# Altium project I2C_Jog_Controller.PrjPCB
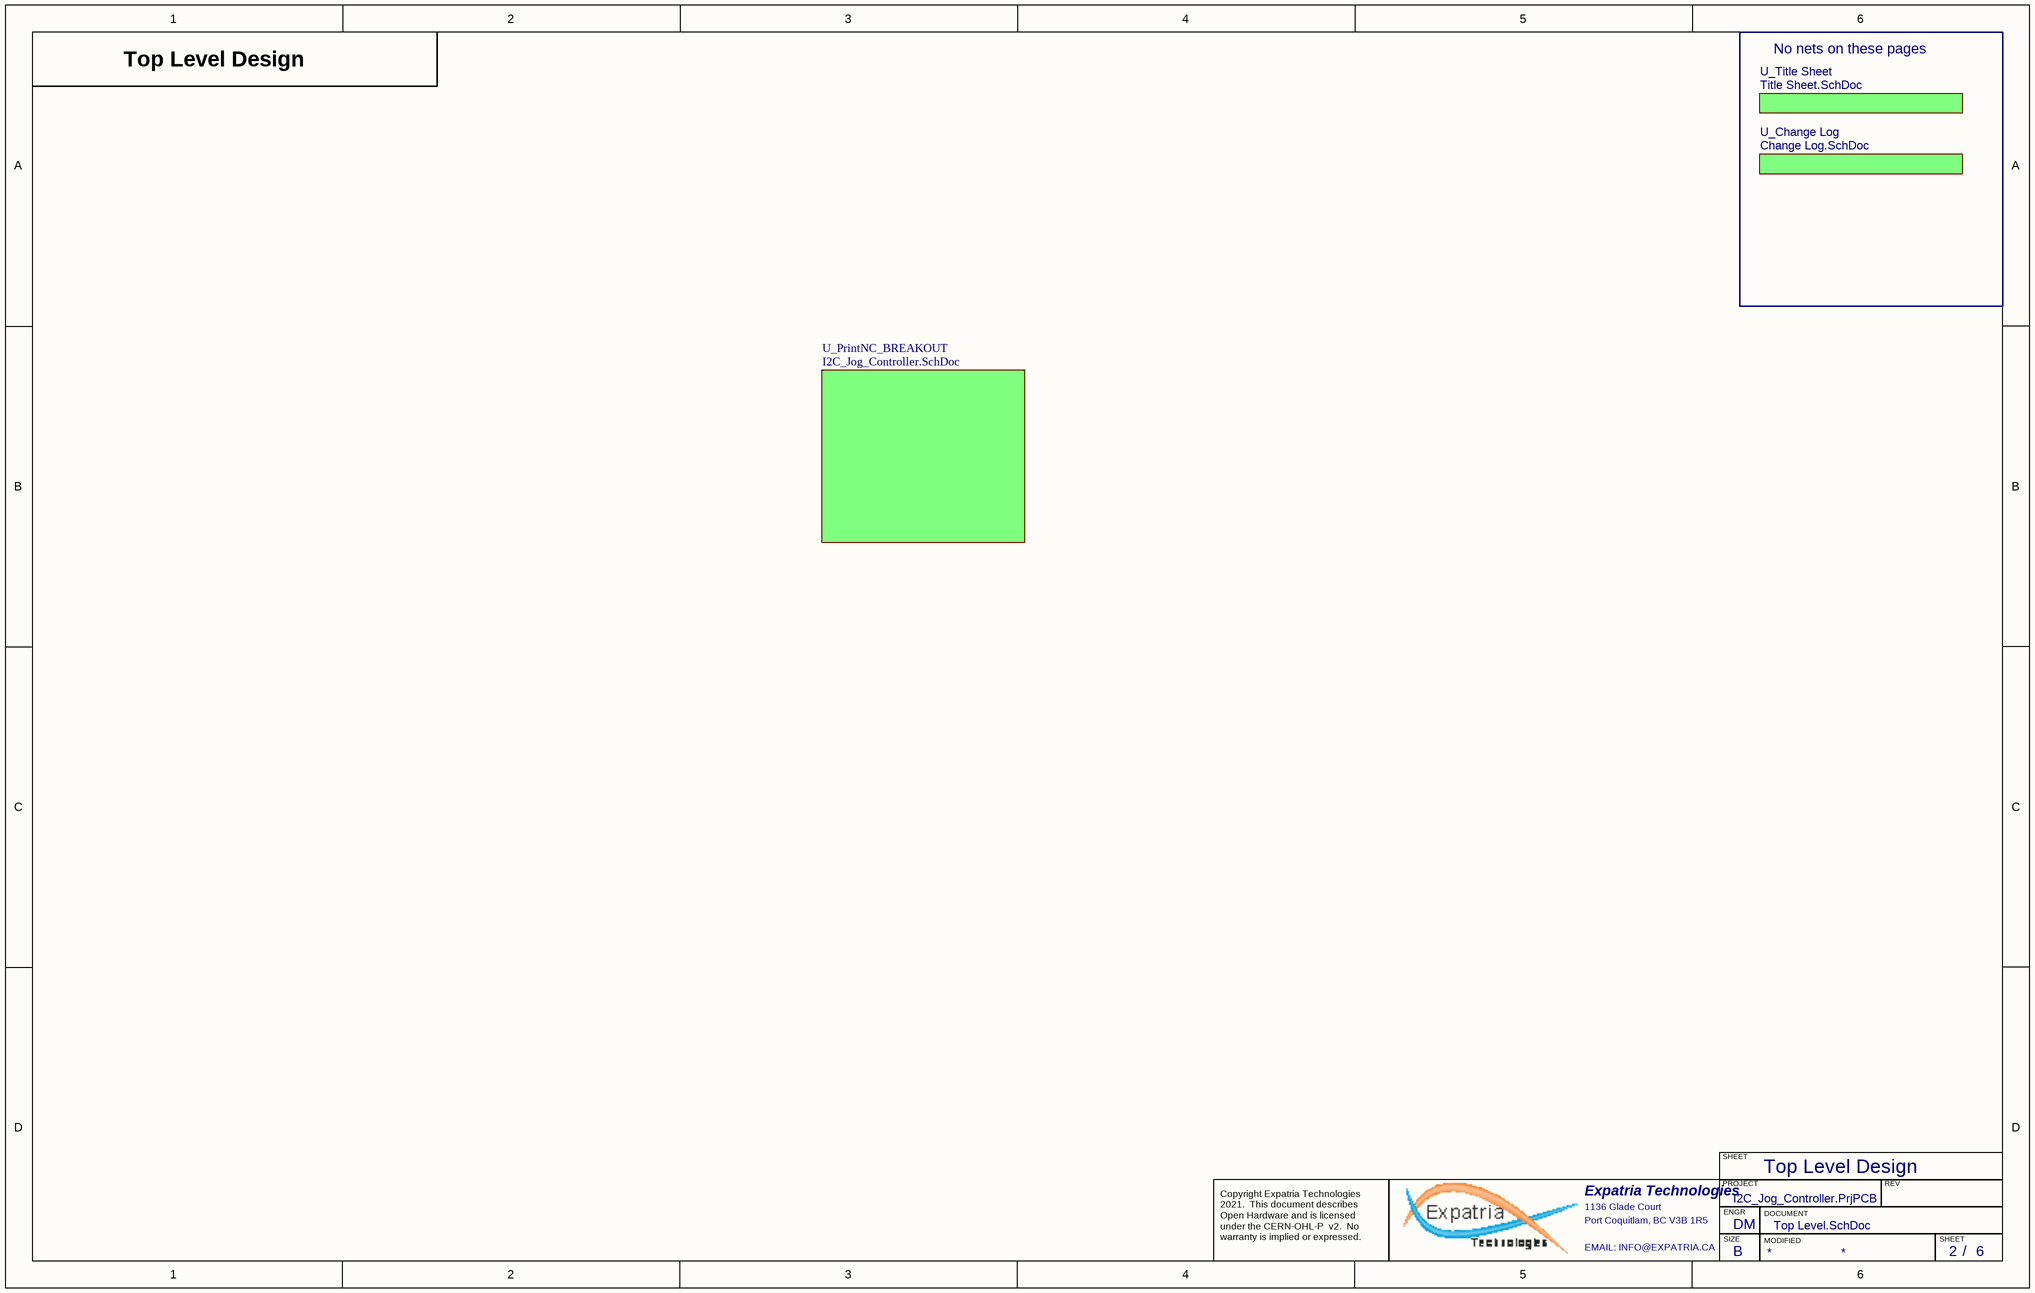
[diagram p0: Top Level.SchDoc]
PCBPARTNO: JOG_CONTROLLER; PCBREVNO: A6; Title: JOG_CONTROLLER; VarRevNo: A6
8 sheets, 212 parts. Net scope: hierarchical (ports join the sheet entries above them; power ports are global).
Board file: I2C_Jog_Controller.pcbdoc
Sheets:
  Top Level.SchDoc
    U_Title Sheet = Title Sheet.SchDoc
    U_PrintNC_BREAKOUT = I2C_Jog_Controller.SchDoc
      EXT_KEYPAD = I2C_Keypad.SchDoc
      UP = PushButtondirection.SchDoc
      DN = PushButtondirection.SchDoc
      LT = PushButtondirection.SchDoc
      RT = PushButtondirection.SchDoc
      RI = PushButtondirection.SchDoc
      LW = PushButtondirection.SchDoc
      JS = PushButtondirection.SchDoc
      FU = PushButtondirection.SchDoc
      FD = PushButtondirection.SchDoc
      FR = PushButtondirection.SchDoc
      SU = PushButtondirection.SchDoc
      SD = PushButtondirection.SchDoc
      SR = PushButtondirection.SchDoc
      SPN = PushButtonBlack.SchDoc
      FLD = PushButtondirection.SchDoc
      MST = PushButtondirection.SchDoc
      CYC = PushButtonBlack.SchDoc
      FHL = PushButtonBlack.SchDoc
      HLT = PushButtonBlack.SchDoc
      HME = PushButtonBlack.SchDoc
      EXT_KEYPAD_HOST = I2C_Keypad_host_module.SchDoc
  RP2040_MCU.SchDoc

## Sheet Top Level.SchDoc: JOG_CONTROLLER
size B; Author: DM; CompanyName: Silver Bullet Technology LLC; DrawnBy: D.McIntire; Engineer: DM; Organization: Silver Bullet Technology; Address1: Schematic; Address2: 5300 Via Andrea; Address3: Newbury Park, CA 91320; Address4: USA; DocumentNumber: 2; Revision: A6; SheetNumber: 2; SheetTotal: 6; PCB_Rev: A6

### Sub-sheets
U_Change Log = Change Log.SchDoc (file not in this document): no entries
U_PrintNC_BREAKOUT = I2C_Jog_Controller.SchDoc: no entries
U_Title Sheet = Title Sheet.SchDoc: no entries

### Notes on the sheet
- Top Level Design
- No nets on these pages
- SHEET
- Expatria Technologies
- 1136 Glade Court
- Port Coquitlam, BC V3B 1R5
- PROJECT
- SIZE
- ENGR
- MODIFIED
- DOCUMENT
- REV
- Copyright Expatria Technologies 2021.  This document describes Open Hardware and is licensed under the CERN-OHL-P  v2.  No warranty is implied or expressed.
- EMAIL: INFO@EXPATRIA.CA
- B
- /

## Sheet Title Sheet.SchDoc: Bluebell MFG PCB
size B; Author: AM; CompanyName: Cambridge Mobile Telematics; DrawnBy: A.Marles; Engineer: DM; Organization: Silver Bullet Technology; Address1: Schematic; Address2: 101 Main Street, 14th Floor; Address3: Cambridge, MA 02142; Address4: USA; DocumentNumber: 1; Revision: A6; SheetNumber: 1; SheetTotal: 6
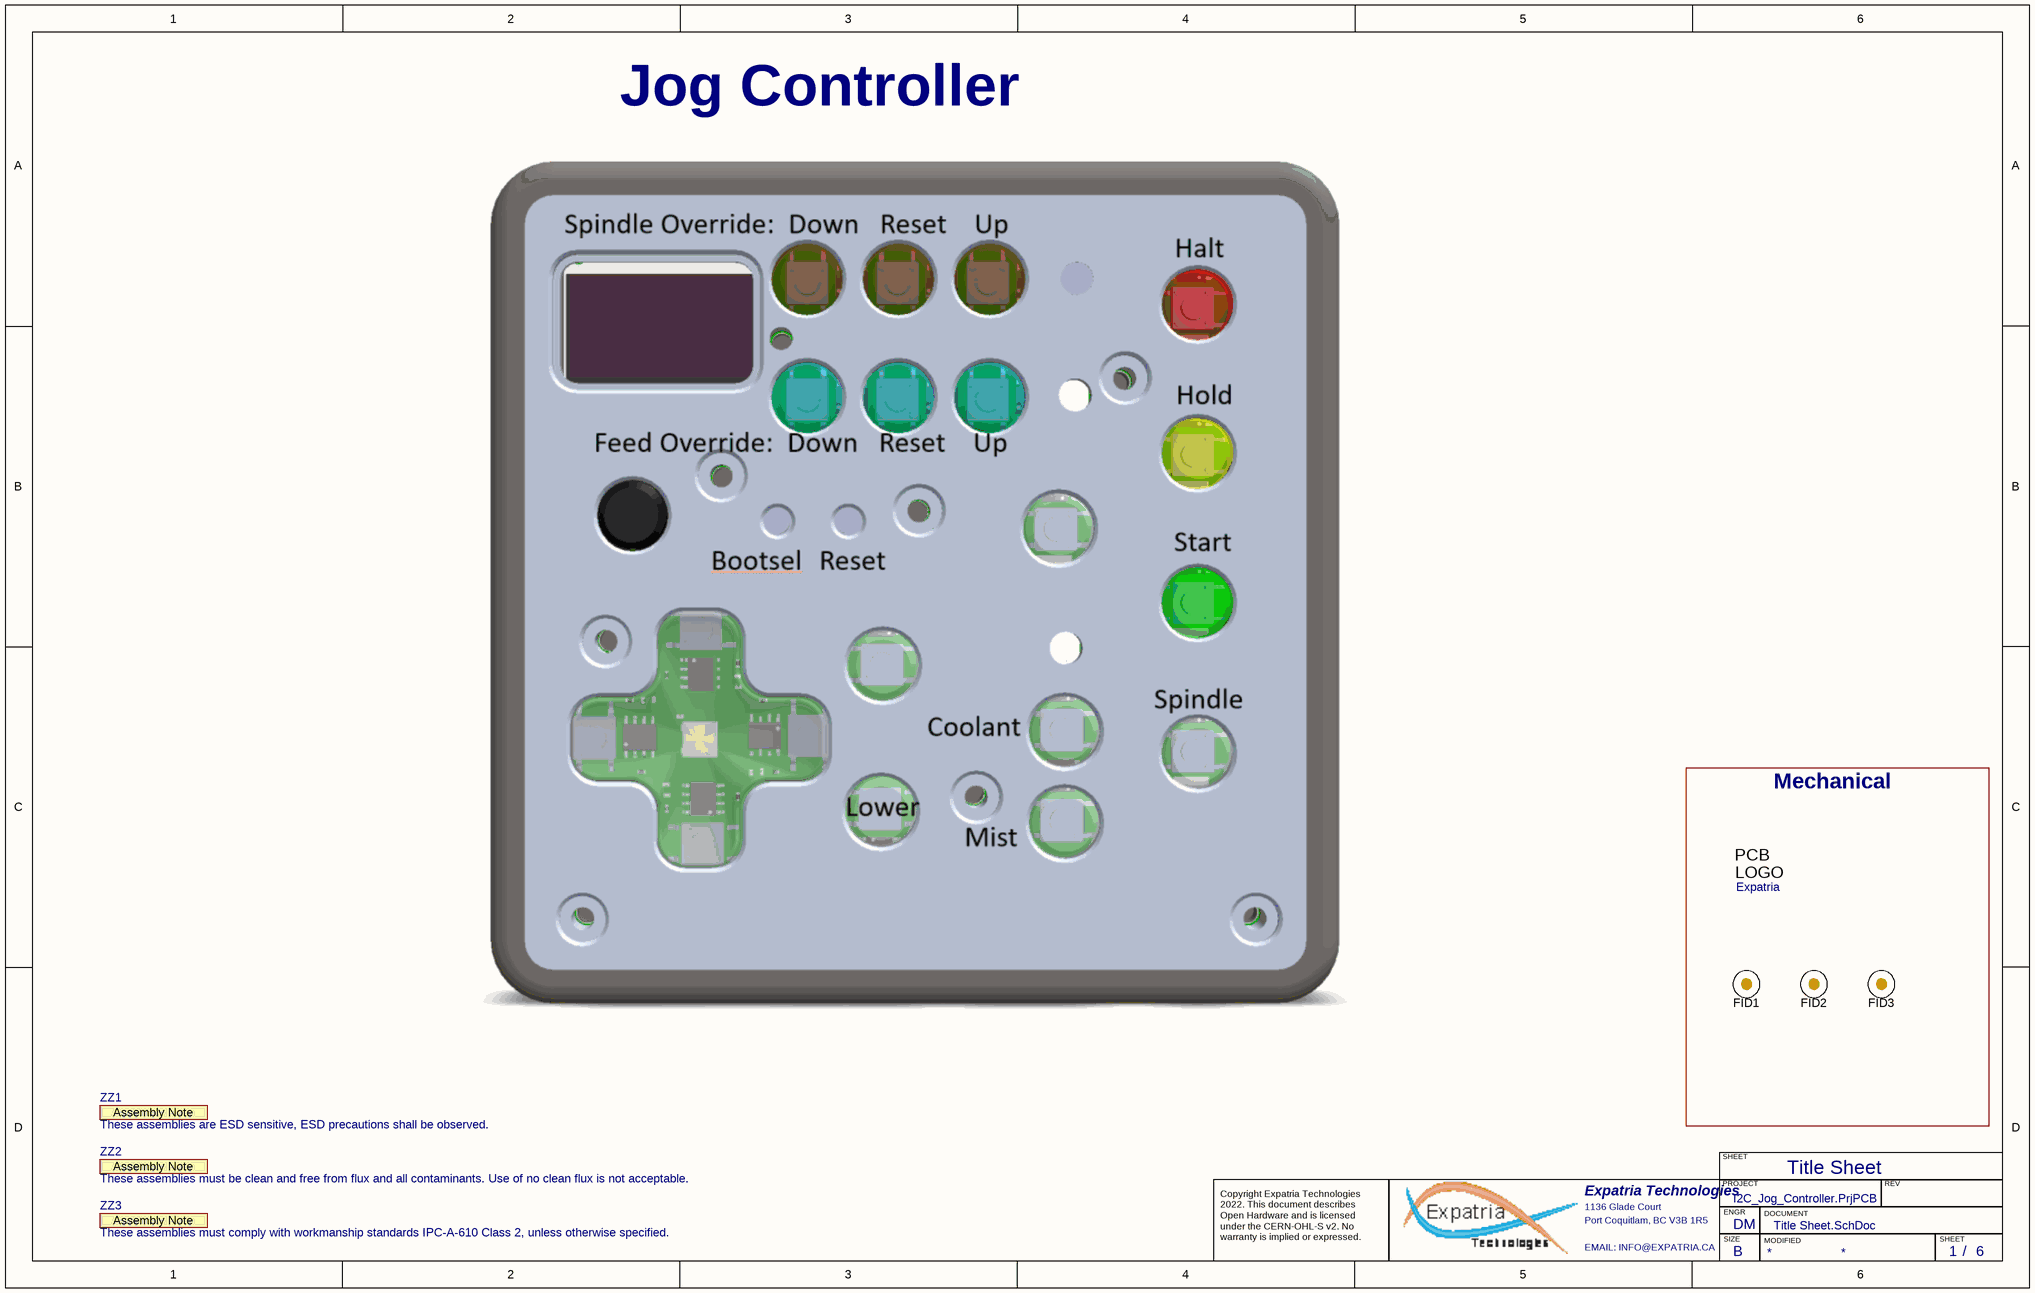
[diagram p1: Title Sheet.SchDoc]

### Parts
FID1  Fiducial  [Fiducial10-20]  (value not drawn)  (no BOM)
FID2  Fiducial  [Fiducial10-20]  (value not drawn)  (no BOM)
FID3  Fiducial  [Fiducial10-20]  (value not drawn)  (no BOM)
Logo1  Expatria  [Expatria-Logo]  (no BOM)
ZZ1  These assemblies are ESD sensitive, ESD precautions shall be observed.  [AssemblyNote]  (graphical)
ZZ2  These assemblies must be clean and free from flux and all contaminants. Use of no clean flux is not acceptable.  [AssemblyNote]  (graphical)
ZZ3  These assemblies must comply with workmanship standards IPC-A-610 Class 2, unless otherwise specified.  [AssemblyNote]  (graphical)

### Blocks framed on the sheet
Mechanical: FID1-FID3 Logo1

### Notes on the sheet
- Jog Controller
- Title Sheet
- SHEET
- Expatria Technologies
- 1136 Glade Court
- Port Coquitlam, BC V3B 1R5
- PROJECT
- SIZE
- ENGR
- MODIFIED
- DOCUMENT
- REV
- Copyright Expatria Technologies 2022. This document describes Open Hardware and is licensed under the CERN-OHL-S v2. No warranty is implied or expressed.
- EMAIL: INFO@EXPATRIA.CA
- B
- /
- (in symbol AssemblyNote) Assembly Note
- (in symbol SBT-Logo) PCB; LOGO

### Library data of the parts
FID1-FID3 = Fiducial: FIDUCIAL NO ASSEMBLY; Manufacturer 1: NONE; Manufacturer Part Number 1: NONE; Value: Fiducial
Logo1 = SBT-Logo: Expatria Logo; Manufacturer 1: NONE; Value: SBT LOGO; Manufacturer Part Number 1: NONE
ZZ1-ZZ3 = AssemblyNote: SymbolCreator: codlsc; SymbolVersion: 2010-05-18; CompType: AssemblyNote; ClassName: AssemblyNote; Publisher: Texas Instruments; LatestRevisionDate: 2012-06-14; LatestRevisionNote: Initial Version; Alternate Manufacturer: -; Alternate PartNumber: -

## Sheet I2C_Jog_Controller.SchDoc: Bluebell MFG PCB
size C; Author: AM; CompanyName: Cambridge Mobile Telematics; DrawnBy: A.Marles; Engineer: DM; Organization: Silver Bullet Technology; Address1: Schematic; Address2: 101 Main Street, 14th Floor; Address3: Cambridge, MA 02142; Address4: USA; DocumentNumber: 3; Revision: A6; SheetNumber: 3; SheetTotal: 6
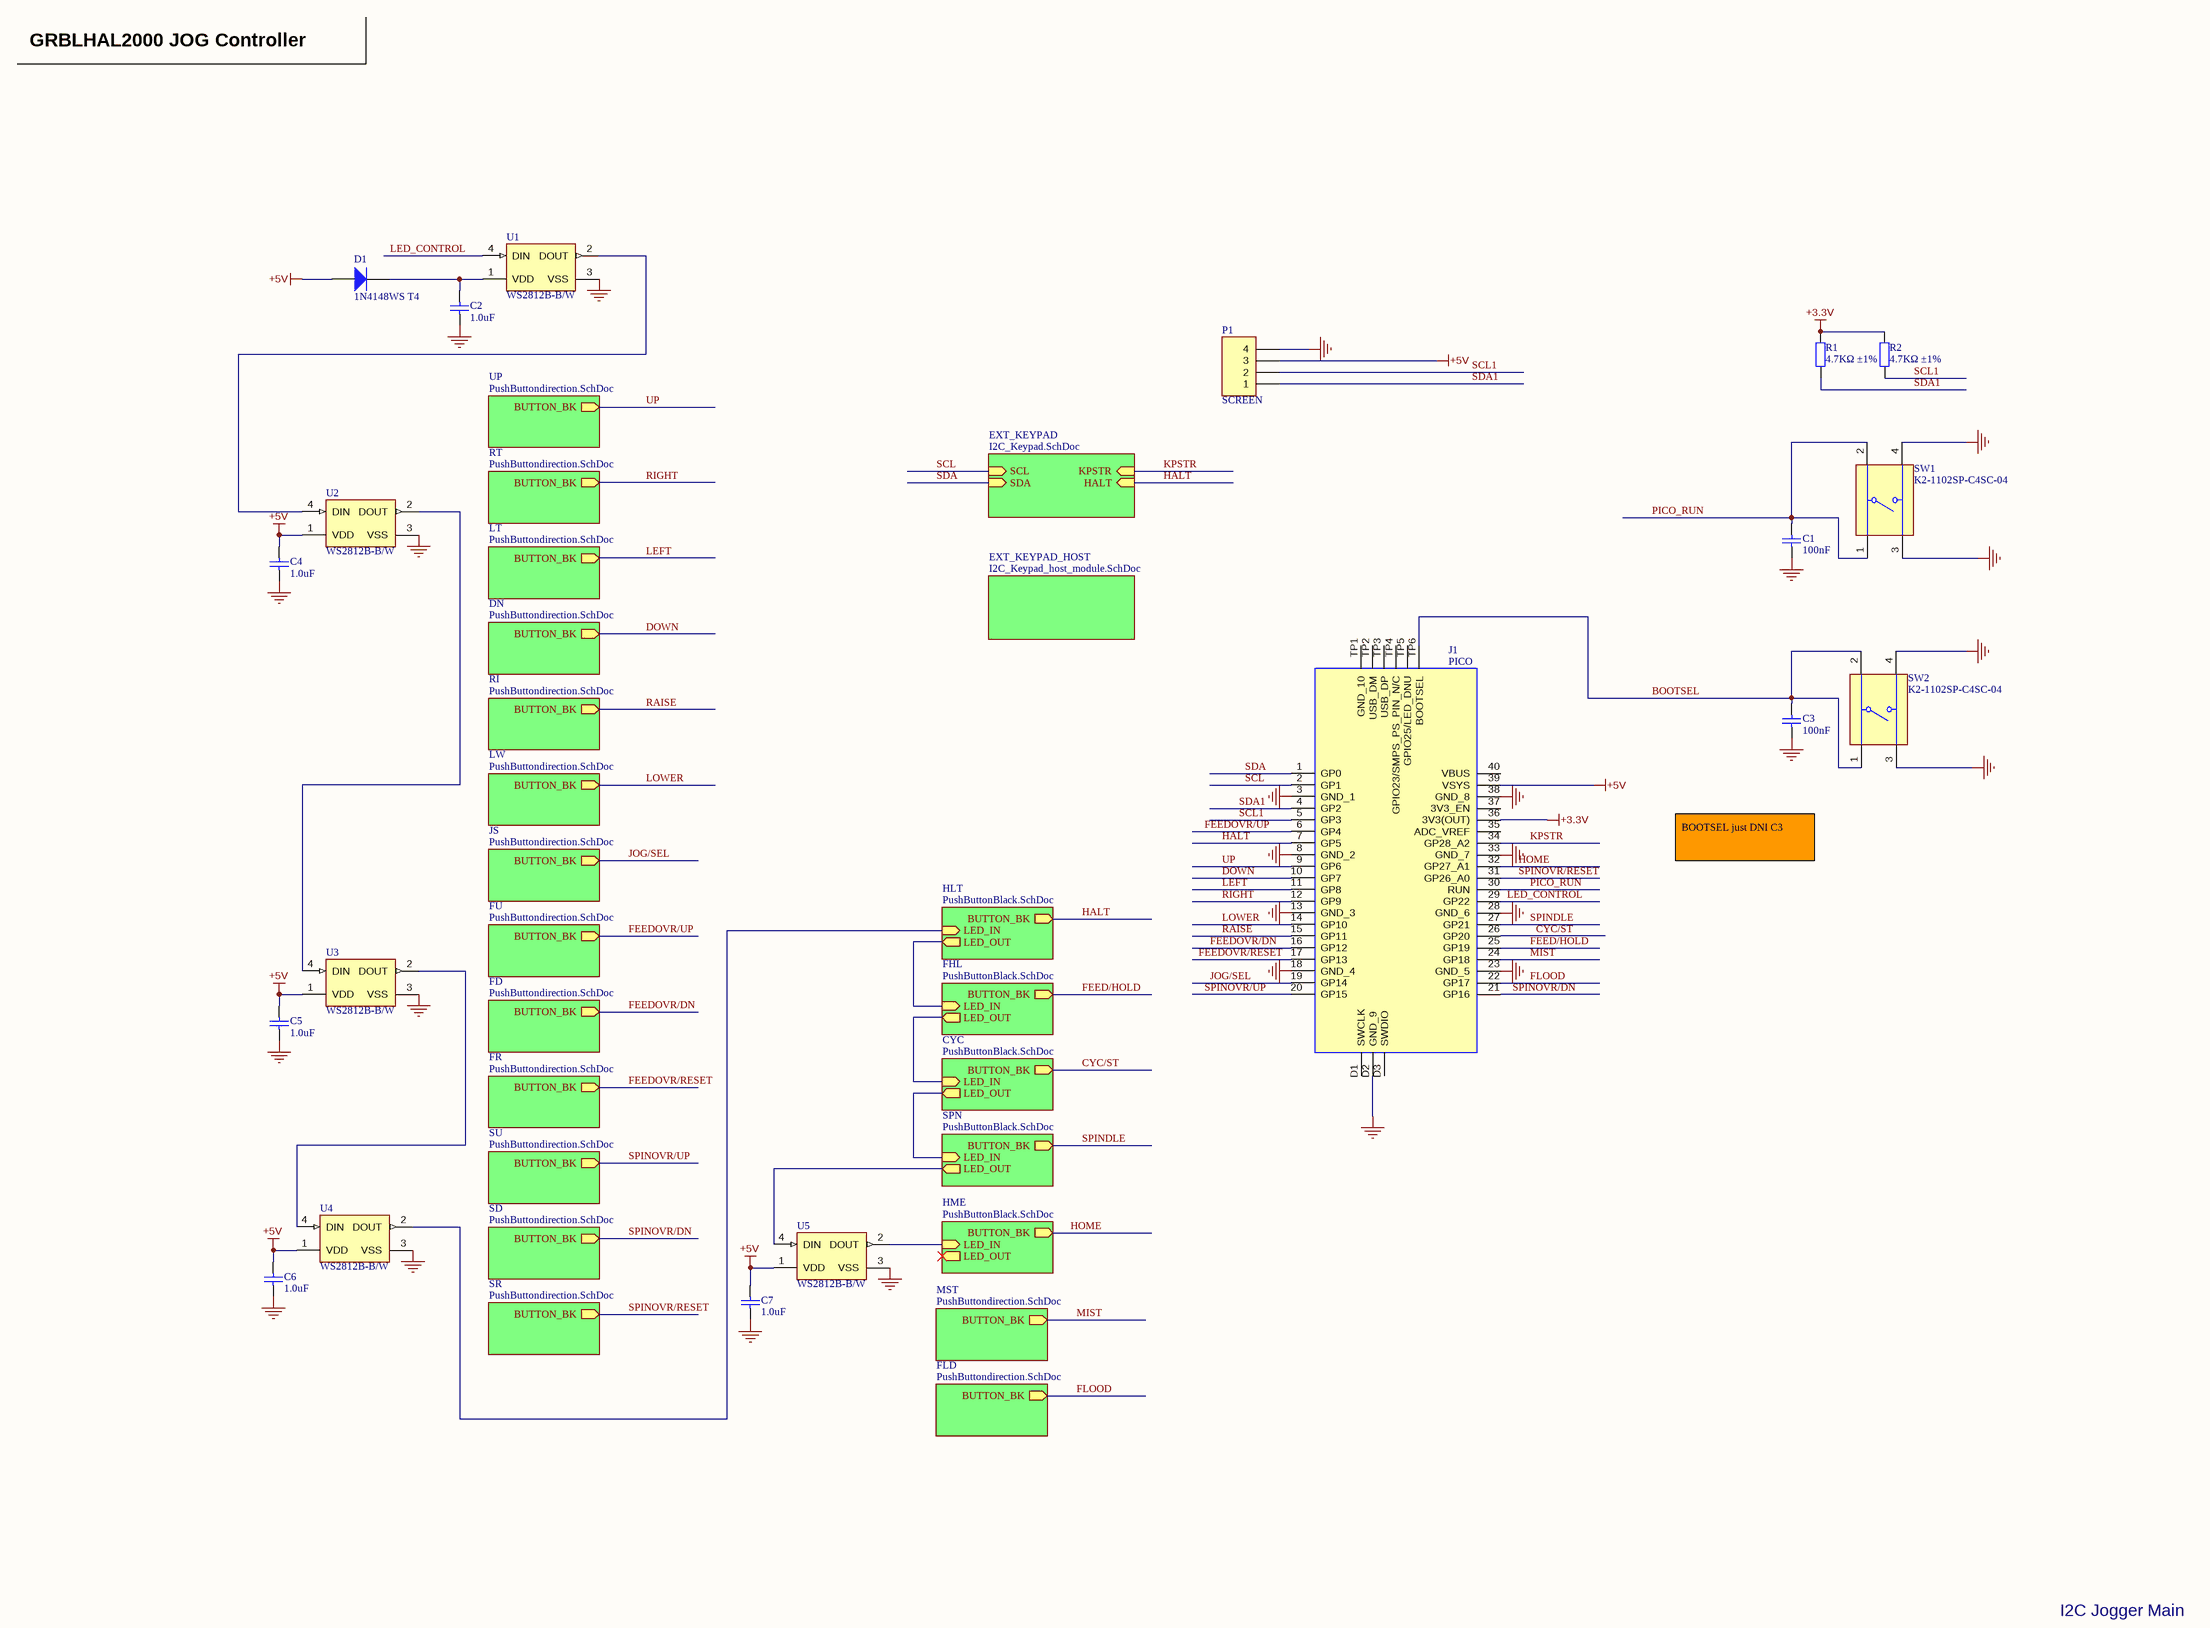
[diagram p2: I2C_Jog_Controller.SchDoc]

### Parts
(Parts that share a designator on the sheet are numbered #1, #2 ... from top to bottom, then left to right.)
C1  100nF  [0402_C]  (no BOM)
C2  1.0uF  [0402_C]
C3  100nF  [0402_C]  (no BOM)
C4  1.0uF  [0402_C]
C5  1.0uF  [0402_C]
C6  1.0uF  [0402_C]
C7  1.0uF  [0402_C]
D1  1N4148WS T4  [SOD-323]
J1#1  PICO  [PICO]  (no BOM)
P1  SCREEN  [HDR1X4]  (no BOM)
R1  4.7KΩ ±1%  [0402_R]
R2  4.7KΩ ±1%  [0402_R]
SW1  K2-1102SP-C4SC-04  [TECO-FSM4JSMATR_V]
SW2  K2-1102SP-C4SC-04  [TECO-FSM4JSMATR_V]
U1  WS2812B-B/W  [ADA-RGB-1655_V]
U2  WS2812B-B/W  [ADA-RGB-1655_V]
U3  WS2812B-B/W  [ADA-RGB-1655_V]
U4  WS2812B-B/W  [ADA-RGB-1655_V]
U5  WS2812B-B/W  [ADA-RGB-1655_V]

### Sub-sheets
CYC = PushButtonBlack.SchDoc: BUTTON_BK (out), LED_IN (in), LED_OUT (out)
DN = PushButtondirection.SchDoc: BUTTON_BK (out)
EXT_KEYPAD = I2C_Keypad.SchDoc: SCL (in), SDA (in), KPSTR (in), HALT (in)
EXT_KEYPAD_HOST = I2C_Keypad_host_module.SchDoc: no entries
FD = PushButtondirection.SchDoc: BUTTON_BK (out)
FHL = PushButtonBlack.SchDoc: BUTTON_BK (out), LED_IN (in), LED_OUT (out)
FLD = PushButtondirection.SchDoc: BUTTON_BK (out)
FR = PushButtondirection.SchDoc: BUTTON_BK (out)
FU = PushButtondirection.SchDoc: BUTTON_BK (out)
HLT = PushButtonBlack.SchDoc: BUTTON_BK (out), LED_IN (in), LED_OUT (out)
HME = PushButtonBlack.SchDoc: BUTTON_BK (out), LED_IN (in), LED_OUT (out)
JS = PushButtondirection.SchDoc: BUTTON_BK (out)
LT = PushButtondirection.SchDoc: BUTTON_BK (out)
LW = PushButtondirection.SchDoc: BUTTON_BK (out)
MST = PushButtondirection.SchDoc: BUTTON_BK (out)
RI = PushButtondirection.SchDoc: BUTTON_BK (out)
RT = PushButtondirection.SchDoc: BUTTON_BK (out)
SD = PushButtondirection.SchDoc: BUTTON_BK (out)
SPN = PushButtonBlack.SchDoc: BUTTON_BK (out), LED_IN (in), LED_OUT (out)
SR = PushButtondirection.SchDoc: BUTTON_BK (out)
SU = PushButtondirection.SchDoc: BUTTON_BK (out)
UP = PushButtondirection.SchDoc: BUTTON_BK (out)

### Nets
+3.3V: J1#1.36(3V3(OUT)) R1.2 R2.2
+5V: C4.2 C5.2 C6.2 C7.2 D1.1(A) J1#1.39(VSYS) P1.3 U2.1(VDD) U3.1(VDD) U4.1(VDD) U5.1(VDD)
GND: C1.1 C2.1 C3.1 C4.1 C5.1 C6.1 C7.1 J1#1.3(GND_1) J1#1.8(GND_2) J1#1.13(GND_3) J1#1.18(GND_4) J1#1.23(GND_5) J1#1.28(GND_6) J1#1.33(GND_7) J1#1.38(GND_8) J1#1.D2(GND_9) P1.4 SW1.3 SW1.4 SW2.3 SW2.4 U1.3(VSS) U2.3(VSS) U3.3(VSS) U4.3(VSS) U5.3(VSS)
BOOTSEL: C3.2 J1#1.TP6(BOOTSEL) SW2.1 SW2.2
CYC/ST: J1#1.26(GP20) ; sheet CYC/BUTTON_BK
DOWN: J1#1.10(GP7) ; sheet DN/BUTTON_BK
FEED/HOLD: J1#1.25(GP19) ; sheet FHL/BUTTON_BK
FEEDOVR/DN: J1#1.16(GP12) ; sheet FD/BUTTON_BK
FEEDOVR/RESET: J1#1.17(GP13) ; sheet FR/BUTTON_BK
FEEDOVR/UP: J1#1.6(GP4) ; sheet FU/BUTTON_BK
FLOOD: J1#1.22(GP17) ; sheet FLD/BUTTON_BK
HALT: J1#1.7(GP5) ; sheet EXT_KEYPAD/HALT, sheet HLT/BUTTON_BK
HOME: J1#1.32(GP27_A1) ; sheet HME/BUTTON_BK
JOG/SEL: J1#1.19(GP14) ; sheet JS/BUTTON_BK
KPSTR: J1#1.34(GP28_A2) ; sheet EXT_KEYPAD/KPSTR
LED_CONTROL: J1#1.29(GP22) U1.4(DIN)
LED_IN: U4.2(DOUT) ; sheet HLT/LED_IN
LED_IN: U5.2(DOUT) ; sheet HME/LED_IN  [a separate net that carries the same name]
LED_IN: sheet SPN/LED_IN, sheet CYC/LED_OUT  [a separate net that carries the same name]
LED_IN: sheet CYC/LED_IN, sheet FHL/LED_OUT  [a separate net that carries the same name]
LED_IN: sheet FHL/LED_IN, sheet HLT/LED_OUT  [a separate net that carries the same name]
LED_OUT: U5.4(DIN) ; sheet SPN/LED_OUT
LEFT: J1#1.11(GP8) ; sheet LT/BUTTON_BK
LOWER: J1#1.14(GP10) ; sheet LW/BUTTON_BK
MIST: J1#1.24(GP18) ; sheet MST/BUTTON_BK
PICO_RUN: C1.2 J1#1.30(RUN) SW1.1 SW1.2
RAISE: J1#1.15(GP11) ; sheet RI/BUTTON_BK
RIGHT: J1#1.12(GP9) ; sheet RT/BUTTON_BK
SCL: J1#1.2(GP1) ; sheet EXT_KEYPAD/SCL
SCL1: J1#1.5(GP3) P1.2 R2.1
SDA: J1#1.1(GP0) ; sheet EXT_KEYPAD/SDA
SDA1: J1#1.4(GP2) P1.1 R1.1
SPINDLE: J1#1.27(GP21) ; sheet SPN/BUTTON_BK
SPINOVR/DN: J1#1.21(GP16) ; sheet SD/BUTTON_BK
SPINOVR/RESET: J1#1.31(GP26_A0) ; sheet SR/BUTTON_BK
SPINOVR/UP: J1#1.20(GP15) ; sheet SU/BUTTON_BK
UP: J1#1.9(GP6) ; sheet UP/BUTTON_BK
NetC2_2: C2.2 D1.2(K) U1.1(VDD)
NetU1_2: U1.2(DOUT) U2.4(DIN)
NetU2_2: U2.2(DOUT) U3.4(DIN)
NetU3_2: U3.2(DOUT) U4.4(DIN)

Not connected (* = marked no-connect by the designer): J1#1 35(ADC_VREF) 37(3V3_EN) 40(VBUS) D1(SWCLK) D3(SWDIO) TP1(GND_10) TP2(USB_DM) TP3(USB_DP) TP4(GPIO23/SMPS_PS_PIN_N/C) TP5(GPIO25/LED_DNU)

### Notes on the sheet
- GRBLHAL2000 JOG Controller
- BOOTSEL just DNI C3
- I2C Jogger Main
- Expatria Technologies
- SHEET
- PROJECT
- REV
- 1136 Glade Court
- Port Coquitlam, BC V3B 1R5
- EMAIL: INFO@EXPATRIA.CA
- SIZE
- ENGR
- C
- MODIFIED
- DOCUMENT
- /
- Copyright Expatria Technologies 2021.  This document describes Open Hardware and is licensed under the CERN-OHL-P  v2.  No warranty is implied or expressed.

### Library data of the parts
C1 C3 = 0402 100nF (104) 10% 16V: Chip capacitors; Manufacturer: Samsung Electro-Mechanics; PartNumber: CL05B104KO5NNNC; Tolerance: 10%; Voltage: 16V; ComponentLink1Description: Supplier link; ComponentLink1URL: http://www.szlcsc.com/product/details_1877.html; Package: 0402; Supplier: LC; SuppliersPartNumber: C1525; Capacitance: 100nF
C2 C4-C7 = 0402 1.0uF (105) 10% 25V: Chip capacitor; Manufacturer: Samsung Electro-Mechanics; PartNumber: CL05A105KA5NQNC; Capacitance: 1uF; Tolerance: 10%; Voltage: 25V; ComponentLink1Description: Supplier link; ComponentLink1URL: http://www.szlcsc.com/product/details_53938.html; Package: 0402; Supplier: LC; SuppliersPartNumber: C52923
D1 = SOD-323 1N4148WS T4: 二极管; ComponentLink1Description: 供应商链接; ComponentLink1URL: http://www.szlcsc.com/product/details_2485.html; Package: SOD-323; Supplier: LC; SuppliersPartNumber: C2128
J1#1 = PICO: Connector; Manufacturer_Name: RASPBERRY-PI; Datasheet Link: https://datasheets.raspberrypi.org/pico/pico_datasheet.pdf; Height: 1mm; Manufacturer_Part_Number: PICO
P1 = Header 4: Header, 4-Pin; LatestRevisionDate: 17-Jul-2002; LatestRevisionNote: Re-released for DXP Platform.; Publisher: Altium Limited
R1 R2 = 0402 4.7K (4701) 1%: Chip resistor; Manufacturer: Uniroyal Elec; PartNumber: 0402WGF4701TCE; Power: 1/16W; ComponentLink1Description: Supplier link; ComponentLink1URL: http://www.szlcsc.com/product/details_26643.html; Package: 0402; Supplier: LC; SuppliersPartNumber: C25900; Resistance: 4.7KΩ; Tolerance: 1%
SW1 SW2 = CMP-2000-07486-1: Top Actuated 50mA @ 12VDC Round Button SPST 6*6mm Tactile Switches ROHS; SuppliersPartNumber: C127509; Package: SMD-4_6.0x6.0x4.5P
U1-U5 = CMP-2000-05026-1: Intelligent Control LED Integrated Light Source, 3.5 to 5.3 V, -25 to 80 degC, 4-Pin SMD, RoHS, Tape and Reel; Manufacturer: Worldsemi; Package Description: 4-Pin Surface Mount Device, Body 5 x 5 mm; SuppliersPartNumber: C2761795; Part_Number: WS2812B-B/W

## Sheet I2C_Keypad.SchDoc: JOG_CONTROLLER
size B; DocumentNumber: 4; SheetNumber: 4; SheetTotal: 6
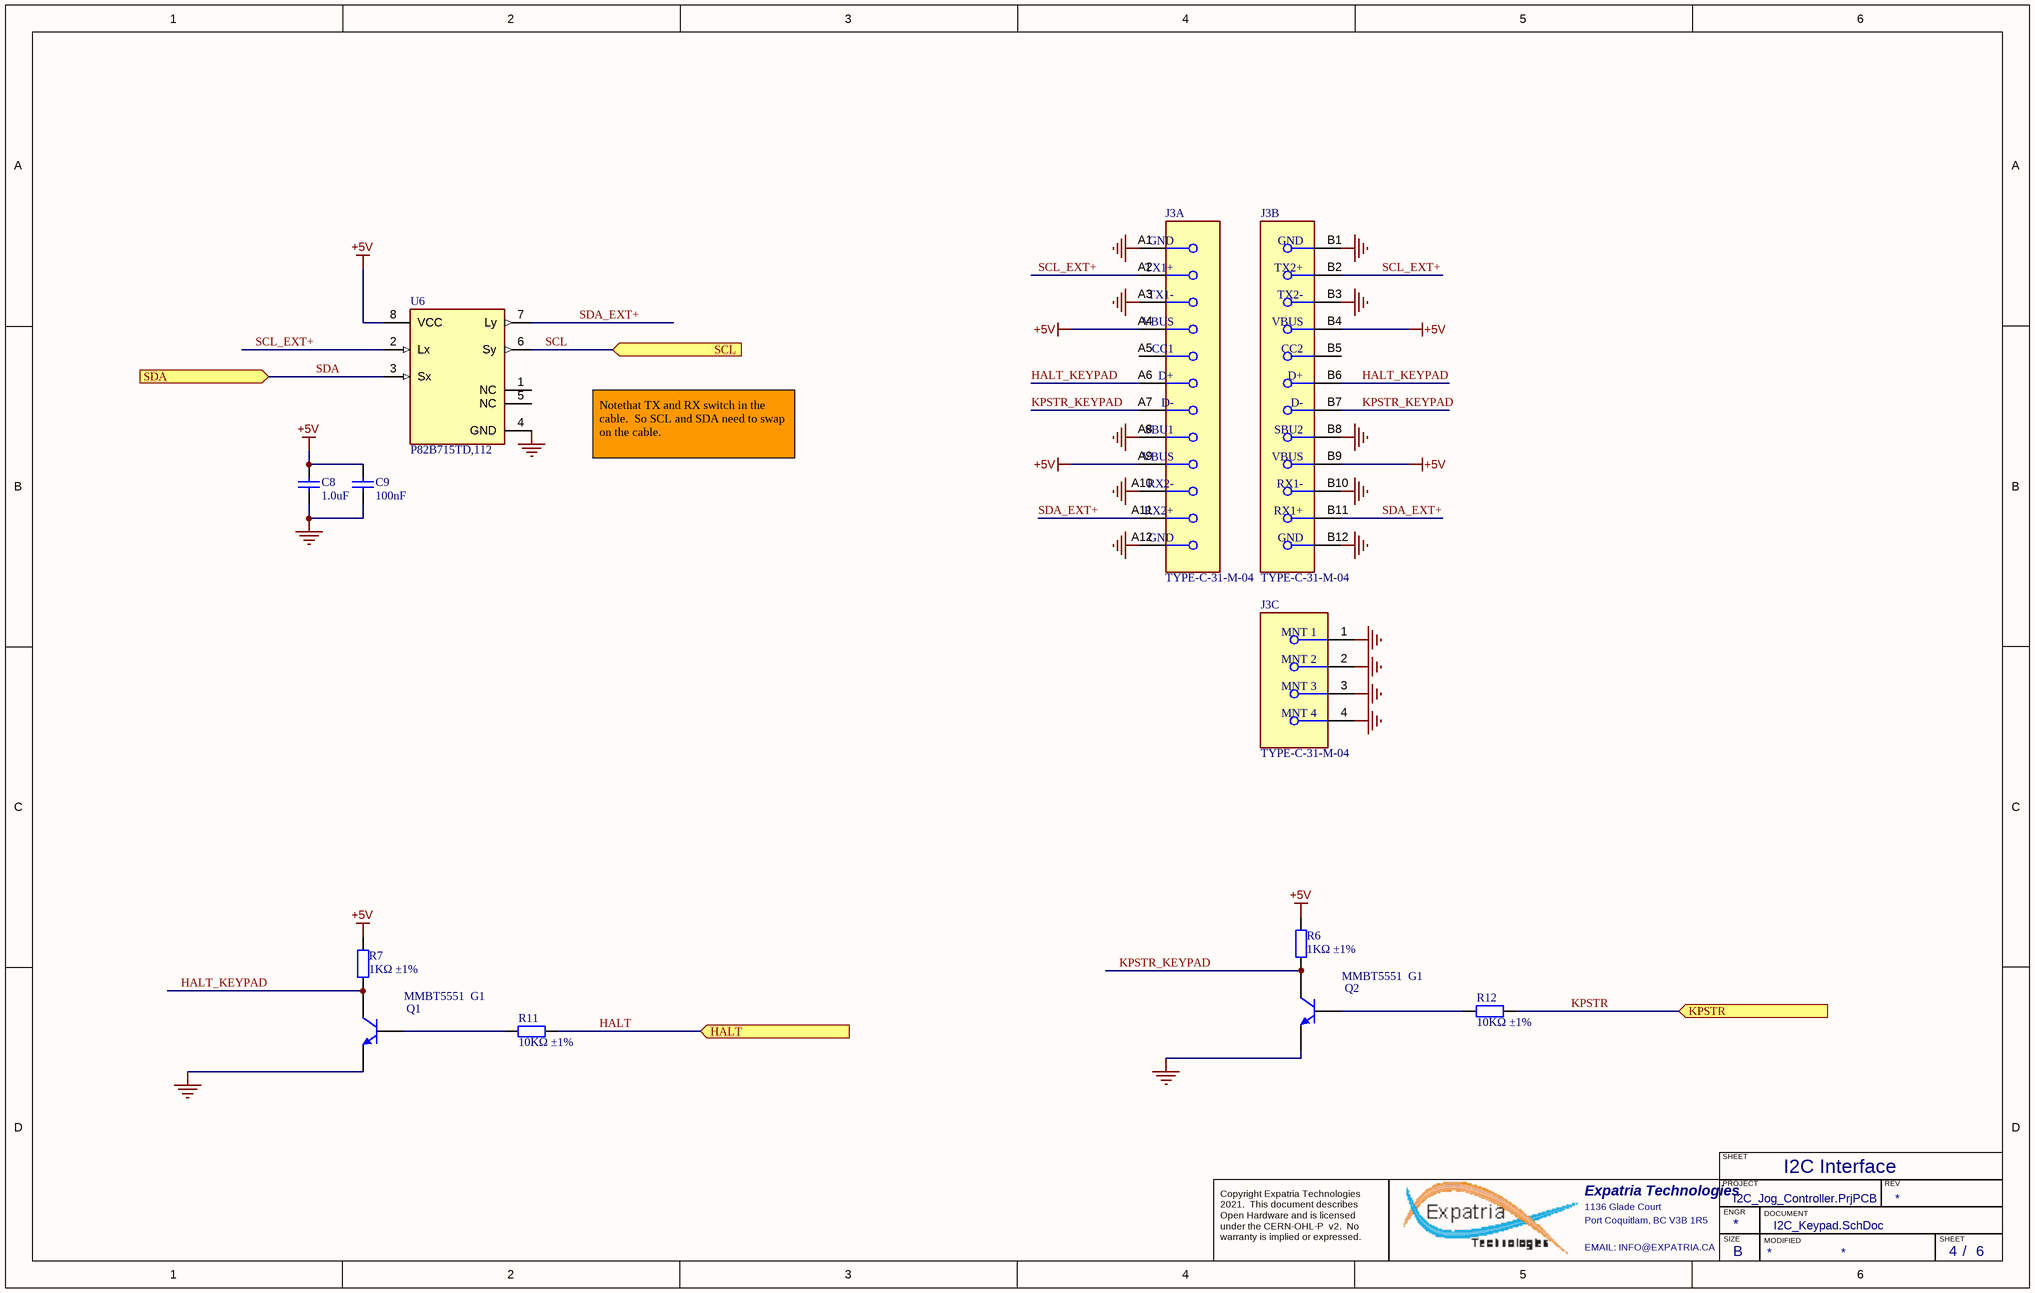
[diagram p3: I2C_Keypad.SchDoc]

### Parts
C8  1.0uF  [0402_C]
C9  100nF  [0402_C]
J3  TYPE-C-31-M-04  [USB-C-SMD_TYPE-C-USB-20]  (parts A,B,C of 3)
Q1  MMBT5551  G1  [SOT-23(SOT-23-3)]
Q2  MMBT5551  G1  [SOT-23(SOT-23-3)]
R6  1KΩ ±1%  [0402_R]
R7  1KΩ ±1%  [0402_R]
R11  10KΩ ±1%  [0402_R]
R12  10KΩ ±1%  [0402_R]
U6  P82B715TD,112  [FP-SOT96-1-MFG]

### Ports
HALT (in), KPSTR (in), SCL (in), SDA (in)

### Nets
+5V: C8.2 C9.2 J3.A4(VBUS) J3.A9(VBUS) J3.B4(VBUS) J3.B9(VBUS) R6.1 R7.1 U6.8(VCC)
GND: C8.1 C9.1 J3.1(MNT_1) J3.2(MNT_2) J3.3(MNT_3) J3.4(MNT_4) J3.A1(GND) J3.A3(TX1-) J3.A8(SBU1) J3.A10(RX2-) J3.A12(GND) J3.B1(GND) J3.B3(TX2-) J3.B8(SBU2) J3.B10(RX1-) J3.B12(GND) Q1.2(E) Q2.2(E) U6.4(GND)
HALT: R11.2 ; port HALT
HALT_KEYPAD: J3.A6(D+) J3.B6(D+) Q1.3(C) R7.2
KPSTR: R12.1 ; port KPSTR
KPSTR_KEYPAD: J3.A7(D-) J3.B7(D-) Q2.3(C) R6.2
SCL: U6.6(Sy) ; port SCL
SCL_EXT+: J3.A2(TX1+) J3.B2(TX2+) U6.2(Lx)
SDA: U6.3(Sx) ; port SDA
SDA_EXT+: J3.A11(RX2+) J3.B11(RX1+) U6.7(Ly)
NetQ1_1: Q1.1(B) R11.1
NetQ2_1: Q2.1(B) R12.2

Not connected (* = marked no-connect by the designer): J3 A5(CC1) B5(CC2); U6 1(NC) 5(NC)

### Notes on the sheet
- Notethat TX and RX switch in the cable.  So SCL and SDA need to swap on the cable.
- I2C Interface
- SHEET
- Expatria Technologies
- 1136 Glade Court
- Port Coquitlam, BC V3B 1R5
- PROJECT
- SIZE
- ENGR
- MODIFIED
- DOCUMENT
- REV
- Copyright Expatria Technologies 2021.  This document describes Open Hardware and is licensed under the CERN-OHL-P  v2.  No warranty is implied or expressed.
- EMAIL: INFO@EXPATRIA.CA
- B
- /

### Library data of the parts
C8 = 0402 1.0uF (105) 10% 25V: as C2 on sheet I2C_Jog_Controller; ComponentLink1Description: Supplier link; ComponentLink1URL: http://www.szlcsc.com/product/details_53938.html; Package: 0402; Supplier: LC; SuppliersPartNumber: C52923
C9 = 0402 100nF (104) 10% 16V: as C1 on sheet I2C_Jog_Controller; ComponentLink1Description: Supplier link; ComponentLink1URL: http://www.szlcsc.com/product/details_1877.html; Package: 0402; Supplier: LC; SuppliersPartNumber: C1525; Capacitance: 100nF
J3 = USBC TYPE-C-31-M-04: CONN RCP USB3.1 TYPEC 24P SMD RA; Manufacturer: Korean Hroparts Elec; Manufacturer Part Number: TYPE-C-31-M-04; SuppliersPartNumber: C129018
Q1 Q2 = SOT-23 MMBT5551  G1: 三极管; ComponentLink1Description: 供应商链接; ComponentLink1URL: http://www.szlcsc.com/product/details_2502.html; Package: SOT-23; Supplier: LC; SuppliersPartNumber: C2145
R6 R7 = 0402 1K (1001) 1%: Chip resistor; Manufacturer: Uniroyal Elec; PartNumber: 0402WGF1001TCE; Power: 1/16W; ComponentLink1Description: Supplier link; ComponentLink1URL: http://www.szlcsc.com/product/details_12256.html; Package: 0402; Supplier: LC; SuppliersPartNumber: C11702; Resistance: 1KΩ; Tolerance: 1%
R11 R12 = 0402 10K (1002) 1%: Chip resistor; Manufacturer: Uniroyal Elec; PartNumber: 0402WGF1002TCE; Power: 1/16W; ComponentLink1Description: Supplier link; ComponentLink1URL: http://www.szlcsc.com/product/details_26487.html; Package: 0402; Supplier: LC; SuppliersPartNumber: C25744; Resistance: 10KΩ; Tolerance: 1%
U6 = CMP-10107-000005-1: IC REDRIVER I2C 1CH 400KHZ 8SO; Manufacturer: NXP Semicon; Manufacturer_Part_Number: P82B715TD,118; Package: SO-8; SuppliersPartNumber: C2652383

## Sheet PushButtondirection.SchDoc: JOG_CONTROLLER
size B; DocumentNumber: 6; SheetNumber: 6; SheetTotal: 6
Used 15 times, as channels U_PrintNC_BREAKOUT/UP, U_PrintNC_BREAKOUT/DN, U_PrintNC_BREAKOUT/LT, U_PrintNC_BREAKOUT/RT, U_PrintNC_BREAKOUT/RI, U_PrintNC_BREAKOUT/LW, U_PrintNC_BREAKOUT/JS, U_PrintNC_BREAKOUT/FU, U_PrintNC_BREAKOUT/FD, U_PrintNC_BREAKOUT/FR, U_PrintNC_BREAKOUT/SU, U_PrintNC_BREAKOUT/SD, U_PrintNC_BREAKOUT/SR, U_PrintNC_BREAKOUT/FLD, U_PrintNC_BREAKOUT/MST. Parts and nets are listed once, with the designators drawn on the sheet.
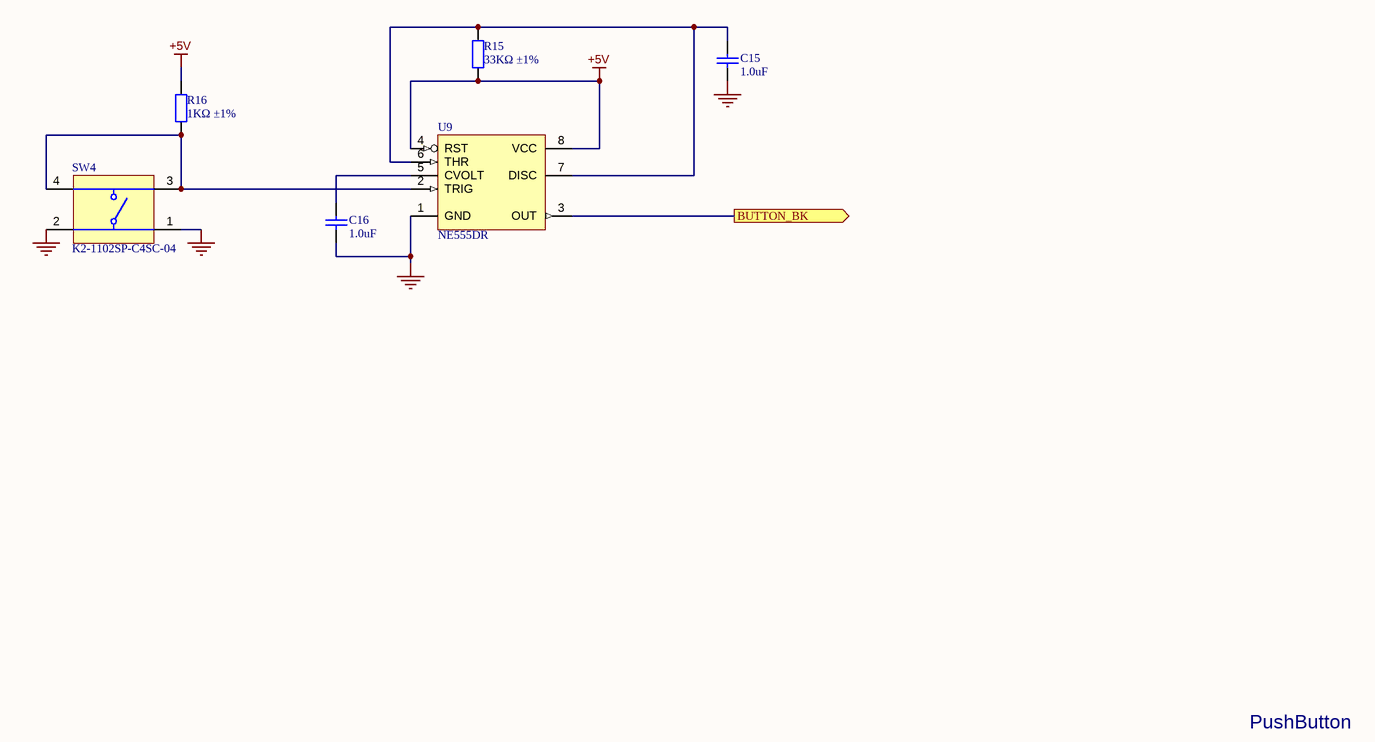
[diagram p4: PushButtondirection.SchDoc]

### Parts
C15  1.0uF  [0402_C]
C16  1.0uF  [0402_C]
R15  33KΩ ±1%  [0402_R]
R16  1KΩ ±1%  [0402_R]
SW4  K2-1102SP-C4SC-04  [TECO-FSM4JSMATR_V]
U9  NE555DR  [SOIC-8_150mil]

### Ports
BUTTON_BK (out)

### Nets
+5V: R15.1 R16.1 U9.4(RST) U9.8(VCC)
GND: C15.1 C16.2 SW4.1 SW4.2 U9.1(GND)
BUTTON_BK: U9.3(OUT) ; port BUTTON_BK
NetC15_2: C15.2 R15.2 U9.6(THR) U9.7(DISC)
NetC16_1: C16.1 U9.5(CVOLT)
NetR16_2: R16.2 SW4.3 SW4.4 U9.2(TRIG)

### Channels
U_PrintNC_BREAKOUT/UP: designators C15=UP_C15 C16=UP_C16 R15=UP_R15 R16=UP_R16 SW4=UP_SW4 U9=UP_U9; ports BUTTON_BK=UP
U_PrintNC_BREAKOUT/DN: designators C15=DN_C15 C16=DN_C16 R15=DN_R15 R16=DN_R16 SW4=DN_SW4 U9=DN_U9; ports BUTTON_BK=DOWN
U_PrintNC_BREAKOUT/LT: designators C15=LT_C15 C16=LT_C16 R15=LT_R15 R16=LT_R16 SW4=LT_SW4 U9=LT_U9; ports BUTTON_BK=LEFT
U_PrintNC_BREAKOUT/RT: designators C15=RT_C15 C16=RT_C16 R15=RT_R15 R16=RT_R16 SW4=RT_SW4 U9=RT_U9; ports BUTTON_BK=RIGHT
U_PrintNC_BREAKOUT/RI: designators C15=RI_C15 C16=RI_C16 R15=RI_R15 R16=RI_R16 SW4=RI_SW4 U9=RI_U9; ports BUTTON_BK=RAISE
U_PrintNC_BREAKOUT/LW: designators C15=LW_C15 C16=LW_C16 R15=LW_R15 R16=LW_R16 SW4=LW_SW4 U9=LW_U9; ports BUTTON_BK=LOWER
U_PrintNC_BREAKOUT/JS: designators C15=JS_C15 C16=JS_C16 R15=JS_R15 R16=JS_R16 SW4=JS_SW4 U9=JS_U9; ports BUTTON_BK=JOG/SEL
U_PrintNC_BREAKOUT/FU: designators C15=FU_C15 C16=FU_C16 R15=FU_R15 R16=FU_R16 SW4=FU_SW4 U9=FU_U9; ports BUTTON_BK=FEEDOVR/UP
U_PrintNC_BREAKOUT/FD: designators C15=FD_C15 C16=FD_C16 R15=FD_R15 R16=FD_R16 SW4=FD_SW4 U9=FD_U9; ports BUTTON_BK=FEEDOVR/DN
U_PrintNC_BREAKOUT/FR: designators C15=FR_C15 C16=FR_C16 R15=FR_R15 R16=FR_R16 SW4=FR_SW4 U9=FR_U9; ports BUTTON_BK=FEEDOVR/RESET
U_PrintNC_BREAKOUT/SU: designators C15=SU_C15 C16=SU_C16 R15=SU_R15 R16=SU_R16 SW4=SU_SW4 U9=SU_U9; ports BUTTON_BK=SPINOVR/UP
U_PrintNC_BREAKOUT/SD: designators C15=SD_C15 C16=SD_C16 R15=SD_R15 R16=SD_R16 SW4=SD_SW4 U9=SD_U9; ports BUTTON_BK=SPINOVR/DN
U_PrintNC_BREAKOUT/SR: designators C15=SR_C15 C16=SR_C16 R15=SR_R15 R16=SR_R16 SW4=SR_SW4 U9=SR_U9; ports BUTTON_BK=SPINOVR/RESET
U_PrintNC_BREAKOUT/FLD: designators C15=FLD_C15 C16=FLD_C16 R15=FLD_R15 R16=FLD_R16 SW4=FLD_SW4 U9=FLD_U9; ports BUTTON_BK=FLOOD
U_PrintNC_BREAKOUT/MST: designators C15=MST_C15 C16=MST_C16 R15=MST_R15 R16=MST_R16 SW4=MST_SW4 U9=MST_U9; ports BUTTON_BK=MIST

### Notes on the sheet
- PushButton
- SHEET
- Expatria Technologies
- 1136 Glade Court
- Port Coquitlam, BC V3B 1R5
- PROJECT
- SIZE
- ENGR
- MODIFIED
- DOCUMENT
- REV
- Copyright Expatria Technologies 2021.  This document describes Open Hardware and is licensed under the CERN-OHL-P  v2.  No warranty is implied or expressed.
- EMAIL: INFO@EXPATRIA.CA
- B
- /

### Library data of the parts
C15 C16 = 0402 1.0uF (105) 10% 25V: as C2 on sheet I2C_Jog_Controller; ComponentLink1Description: Supplier link; ComponentLink1URL: http://www.szlcsc.com/product/details_53938.html; Package: 0402; Supplier: LC; SuppliersPartNumber: C52923
R15 = 0402 33K (3302) 1%: Chip resistor; Manufacturer: Uniroyal Elec; PartNumber: 0402WGF3302TCE; Power: 1/16W; ComponentLink1Description: Supplier link; ComponentLink1URL: http://www.szlcsc.com/product/details_26522.html; Package: 0402; Supplier: LC; SuppliersPartNumber: C25779; Resistance: 33KΩ; Tolerance: 1%
R16 = 0402 1K (1001) 1%: as R6 on sheet I2C_Keypad; ComponentLink1Description: Supplier link; ComponentLink1URL: http://www.szlcsc.com/product/details_12256.html; Package: 0402; Supplier: LC; SuppliersPartNumber: C11702; Resistance: 1KΩ; Tolerance: 1%
SW4 = CMP-2000-07486-1: as SW1 on sheet I2C_Jog_Controller; SuppliersPartNumber: C127509; Package: SMD-4_6.0x6.0x4.5P
U9 = NE555DR_[C7593]: 时基集成; ComponentLink1Description: 供应商链接; ComponentLink1URL: http://www.szlcsc.com/product/details_8070.html; Package: SOIC-8_150mil; Supplier: LC; SuppliersPartNumber: C7593

## Sheet PushButtonBlack.SchDoc: JOG_CONTROLLER
size B; DocumentNumber: 5; SheetNumber: 5; SheetTotal: 6
Used 5 times, as channels U_PrintNC_BREAKOUT/SPN, U_PrintNC_BREAKOUT/CYC, U_PrintNC_BREAKOUT/FHL, U_PrintNC_BREAKOUT/HLT, U_PrintNC_BREAKOUT/HME. Parts and nets are listed once, with the designators drawn on the sheet.
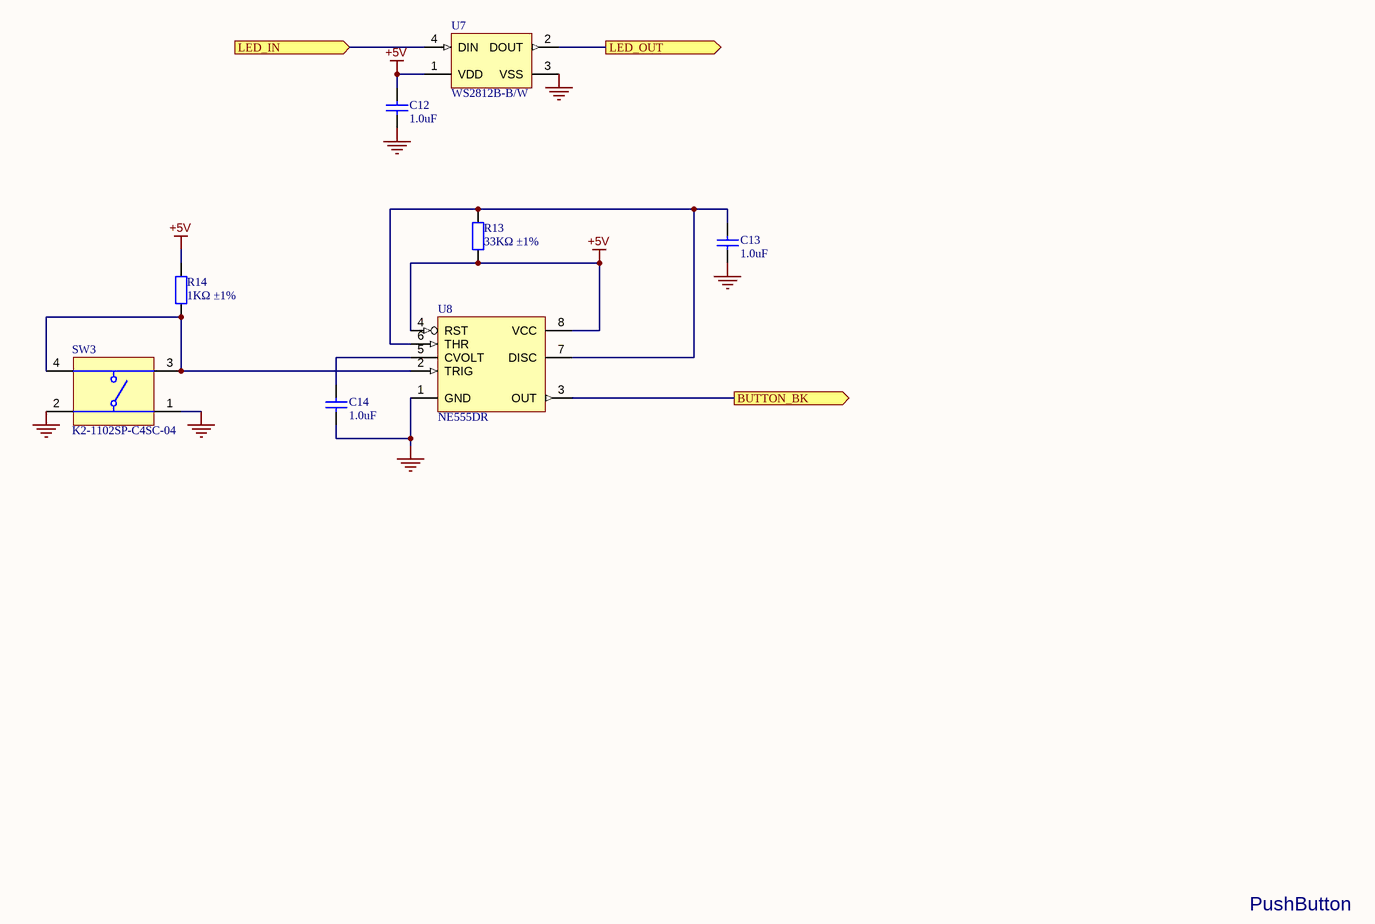
[diagram p5: PushButtonBlack.SchDoc]

### Parts
C12  1.0uF  [0402_C]
C13  1.0uF  [0402_C]
C14  1.0uF  [0402_C]
R13  33KΩ ±1%  [0402_R]
R14  1KΩ ±1%  [0402_R]
SW3  K2-1102SP-C4SC-04  [TECO-FSM4JSMATR_V]
U7  WS2812B-B/W  [ADA-RGB-1655_V]
U8  NE555DR  [SOIC-8_150mil]

### Ports
BUTTON_BK (out), LED_IN (in), LED_OUT (out)

### Nets
+5V: C12.2 R13.1 R14.1 U7.1(VDD) U8.4(RST) U8.8(VCC)
GND: C12.1 C13.1 C14.2 SW3.1 SW3.2 U7.3(VSS) U8.1(GND)
BUTTON_BK: U8.3(OUT) ; port BUTTON_BK
LED_IN: U7.4(DIN) ; port LED_IN
LED_OUT: U7.2(DOUT) ; port LED_OUT
NetC13_2: C13.2 R13.2 U8.6(THR) U8.7(DISC)
NetC14_1: C14.1 U8.5(CVOLT)
NetR14_2: R14.2 SW3.3 SW3.4 U8.2(TRIG)

### Channels
U_PrintNC_BREAKOUT/SPN: designators C12=SPN_C12 C13=SPN_C13 C14=SPN_C14 R13=SPN_R13 R14=SPN_R14 SW3=SPN_SW3 U7=SPN_U7 U8=SPN_U8; ports BUTTON_BK=SPINDLE LED_IN=LED_IN LED_OUT=LED_OUT
U_PrintNC_BREAKOUT/CYC: designators C12=CYC_C12 C13=CYC_C13 C14=CYC_C14 R13=CYC_R13 R14=CYC_R14 SW3=CYC_SW3 U7=CYC_U7 U8=CYC_U8; ports BUTTON_BK=CYC/ST LED_IN=LED_IN LED_OUT=LED_IN
U_PrintNC_BREAKOUT/FHL: designators C12=FHL_C12 C13=FHL_C13 C14=FHL_C14 R13=FHL_R13 R14=FHL_R14 SW3=FHL_SW3 U7=FHL_U7 U8=FHL_U8; ports BUTTON_BK=FEED/HOLD LED_IN=LED_IN LED_OUT=LED_IN
U_PrintNC_BREAKOUT/HLT: designators C12=HLT_C12 C13=HLT_C13 C14=HLT_C14 R13=HLT_R13 R14=HLT_R14 SW3=HLT_SW3 U7=HLT_U7 U8=HLT_U8; ports BUTTON_BK=HALT LED_IN=LED_IN LED_OUT=LED_IN
U_PrintNC_BREAKOUT/HME: designators C12=HME_C12 C13=HME_C13 C14=HME_C14 R13=HME_R13 R14=HME_R14 SW3=HME_SW3 U7=HME_U7 U8=HME_U8; ports BUTTON_BK=HOME LED_IN=LED_IN LED_OUT=LED_OUT_HME

### Notes on the sheet
- PushButton
- SHEET
- Expatria Technologies
- 1136 Glade Court
- Port Coquitlam, BC V3B 1R5
- PROJECT
- SIZE
- ENGR
- MODIFIED
- DOCUMENT
- REV
- Copyright Expatria Technologies 2021.  This document describes Open Hardware and is licensed under the CERN-OHL-P  v2.  No warranty is implied or expressed.
- EMAIL: INFO@EXPATRIA.CA
- B
- /

### Library data of the parts
C12-C14 = 0402 1.0uF (105) 10% 25V: as C2 on sheet I2C_Jog_Controller; ComponentLink1Description: Supplier link; ComponentLink1URL: http://www.szlcsc.com/product/details_53938.html; Package: 0402; Supplier: LC; SuppliersPartNumber: C52923
R13 = 0402 33K (3302) 1%: as R15 on sheet PushButtondirection; ComponentLink1Description: Supplier link; ComponentLink1URL: http://www.szlcsc.com/product/details_26522.html; Package: 0402; Supplier: LC; SuppliersPartNumber: C25779; Resistance: 33KΩ; Tolerance: 1%
R14 = 0402 1K (1001) 1%: as R6 on sheet I2C_Keypad; ComponentLink1Description: Supplier link; ComponentLink1URL: http://www.szlcsc.com/product/details_12256.html; Package: 0402; Supplier: LC; SuppliersPartNumber: C11702; Resistance: 1KΩ; Tolerance: 1%
SW3 = CMP-2000-07486-1: as SW1 on sheet I2C_Jog_Controller; SuppliersPartNumber: C127509; Package: SMD-4_6.0x6.0x4.5P
U7 = CMP-2000-05026-1: as U1 on sheet I2C_Jog_Controller; Package Description: 4-Pin Surface Mount Device, Body 5 x 5 mm; SuppliersPartNumber: C2761795; Part_Number: WS2812B-B/W
U8 = NE555DR_[C7593]: 时基集成; ComponentLink1Description: 供应商链接; ComponentLink1URL: http://www.szlcsc.com/product/details_8070.html; Package: SOIC-8_150mil; Supplier: LC; SuppliersPartNumber: C7593

## Sheet I2C_Keypad_host_module.SchDoc: JOG_CONTROLLER
size B; Author: AM; CompanyName: Expatria Technologies; DrawnBy: A.Marles; Engineer: AM; Organization: Expatria Technologies; DocumentNumber: 13; Revision: A1; SheetNumber: 13; SheetTotal: 14; PCB_Rev: A1
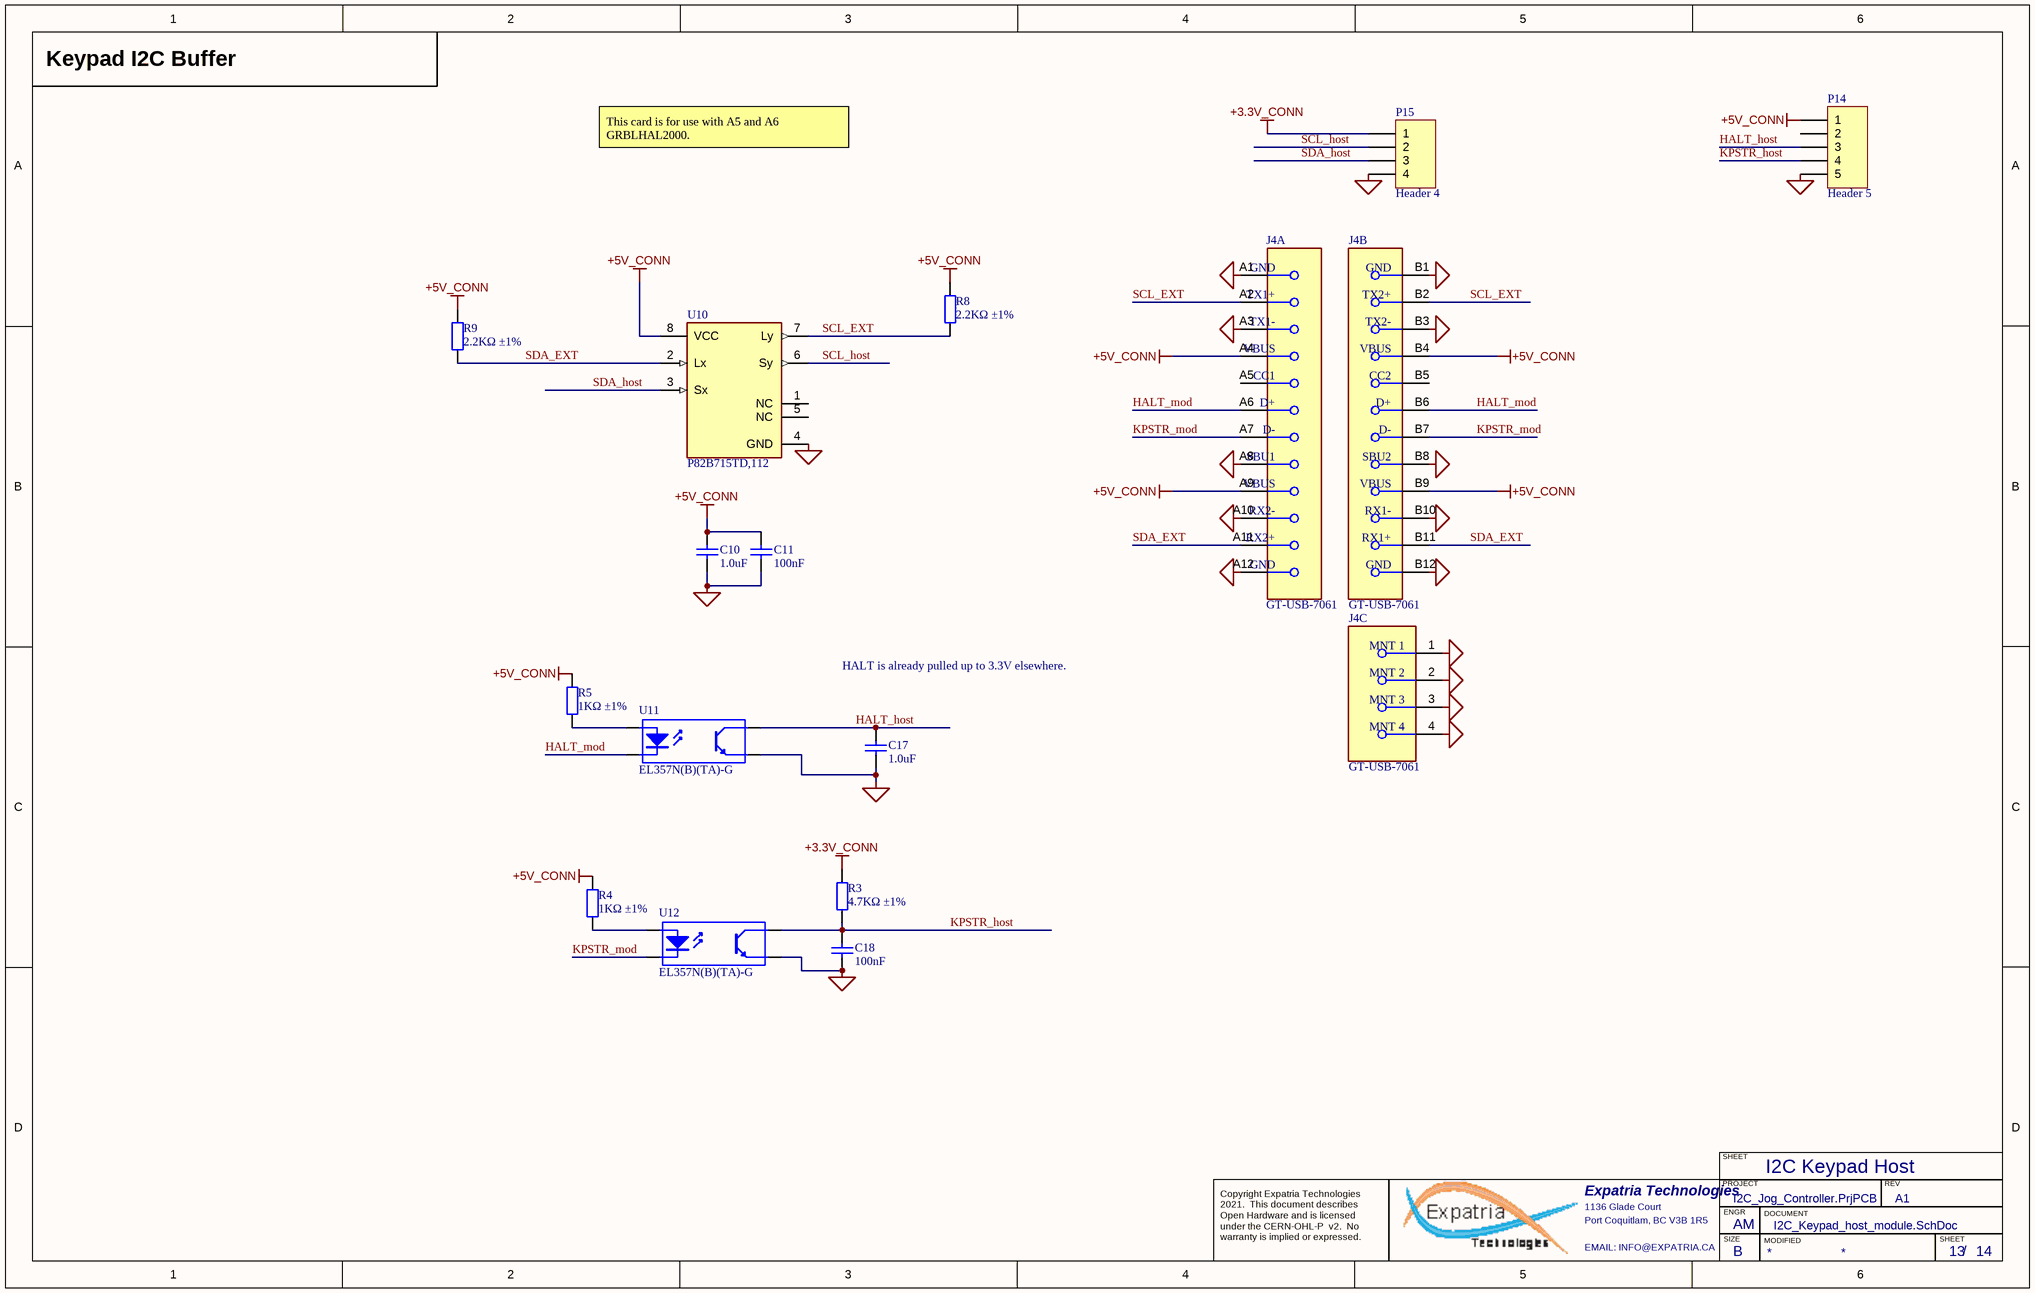
[diagram p6: I2C_Keypad_host_module.SchDoc]

### Parts
C10  1.0uF  [0402_C]
C11  100nF  [0402_C]
C17  1.0uF  [0402_C]
C18  100nF  [0402_C]
J4  GT-USB-7061  [USB-C-SMD_GT-USB-7061]  (parts A,B,C of 3)
P14  Header 5  [HDR1X5]  (no BOM)
P15  Header 4  [HDR1X4]  (no BOM)
R3  4.7KΩ ±1%  [0402_R]
R4  1KΩ ±1%  [0402_R]
R5  1KΩ ±1%  [0402_R]
R8  2.2KΩ ±1%  [0402_R]
R9  2.2KΩ ±1%  [0402_R]
U10  P82B715TD,112  [FP-SOT96-1-MFG]
U11  EL357N(B)(TA)-G  [SOP-4_P2.54]
U12  EL357N(B)(TA)-G  [SOP-4_P2.54]

### Nets
+3.3V_CONN: P15.1 R3.2
+5V_CONN: C10.2 C11.2 J4.A4(VBUS) J4.A9(VBUS) J4.B4(VBUS) J4.B9(VBUS) P14.1 R4.1 R5.1 R8.2 R9.2 U10.8(VCC)
GND_CONN: C10.1 C11.1 C17.1 C18.1 J4.1(MNT_1) J4.2(MNT_2) J4.3(MNT_3) J4.4(MNT_4) J4.A1(GND) J4.A3(TX1-) J4.A8(SBU1) J4.A10(RX2-) J4.A12(GND) J4.B1(GND) J4.B3(TX2-) J4.B8(SBU2) J4.B10(RX1-) J4.B12(GND) P14.5 P15.4 U10.4(GND) U11.3(E) U12.3(E)
HALT_host: C17.2 P14.3 U11.4(C)
HALT_mod: J4.A6(D+) J4.B6(D+) U11.2(K)
KPSTR_host: C18.2 P14.4 R3.1 U12.4(C)
KPSTR_mod: J4.A7(D-) J4.B7(D-) U12.2(K)
SCL_EXT: J4.A2(TX1+) J4.B2(TX2+) R8.1 U10.7(Ly)
SCL_host: P15.2 U10.6(Sy)
SDA_EXT: J4.A11(RX2+) J4.B11(RX1+) R9.1 U10.2(Lx)
SDA_host: P15.3 U10.3(Sx)
NetR4_2: R4.2 U12.1(A)
NetR5_2: R5.2 U11.1(A)

Not connected (* = marked no-connect by the designer): J4 A5(CC1) B5(CC2); P14 2; U10 1(NC) 5(NC)

### Notes on the sheet
- Keypad I2C Buffer
- This card is for use with A5 and A6 GRBLHAL2000.
- HALT is already pulled up to 3.3V elsewhere.
- I2C Keypad Host
- SHEET
- Expatria Technologies
- 1136 Glade Court
- Port Coquitlam, BC V3B 1R5
- PROJECT
- SIZE
- ENGR
- MODIFIED
- DOCUMENT
- REV
- Copyright Expatria Technologies 2021.  This document describes Open Hardware and is licensed under the CERN-OHL-P  v2.  No warranty is implied or expressed.
- EMAIL: INFO@EXPATRIA.CA
- B
- /

### Library data of the parts
C10 C17 = 0402 1.0uF (105) 10% 25V: as C2 on sheet I2C_Jog_Controller; ComponentLink1Description: Supplier link; ComponentLink1URL: http://www.szlcsc.com/product/details_53938.html; Package: 0402; Supplier: LC; SuppliersPartNumber: C52923
C11 C18 = 0402 100nF (104) 10% 16V: as C1 on sheet I2C_Jog_Controller; ComponentLink1Description: Supplier link; ComponentLink1URL: http://www.szlcsc.com/product/details_1877.html; Package: 0402; Supplier: LC; SuppliersPartNumber: C1525; Capacitance: 100nF
J4 = USBC-GT-USB-7061: CONN RCP USB3.1 TYPEC 24P SMD VERT; Manufacturer: G-Switch; Manufacturer Part Number: GT-USB-7061; SuppliersPartNumber: C2762983
P14 = Header 5: Header, 5-Pin; LatestRevisionDate: 17-Jul-2002; LatestRevisionNote: Re-released for DXP Platform.; Publisher: Altium Limited; SuppliersPartNumber: C124379
P15 = Header 4: Header, 4-Pin; Publisher: Altium Limited; SuppliersPartNumber: C124378
R3 = 0402 4.7K (4701) 1%: as R1 on sheet I2C_Jog_Controller; ComponentLink1Description: Supplier link; ComponentLink1URL: http://www.szlcsc.com/product/details_26643.html; Package: 0402; Supplier: LC; SuppliersPartNumber: C25900; Resistance: 4.7KΩ; Tolerance: 1%
R4 R5 = 0402 1K (1001) 1%: as R6 on sheet I2C_Keypad; ComponentLink1Description: Supplier link; ComponentLink1URL: http://www.szlcsc.com/product/details_12256.html; Package: 0402; Supplier: LC; SuppliersPartNumber: C11702; Resistance: 1KΩ; Tolerance: 1%
R8 R9 = 0402 2.2K (2201) 1%: Chip resistor; Manufacturer: Uniroyal Elec; PartNumber: 0402WGF2201TCE; Power: 1/16W; ComponentLink1Description: Supplier link; ComponentLink1URL: http://www.szlcsc.com/product/details_26622.html; Package: 0402; Supplier: LC; SuppliersPartNumber: C25879; Resistance: 2.2KΩ; Tolerance: 1%
U10 = CMP-10107-000005-1: as U6 on sheet I2C_Keypad; Package: SO-8; SuppliersPartNumber: C2652383
U11 U12 = EL357N(B)(TA)-G_[C6649]: 贴片光耦; ComponentLink1Description: 供应商链接; ComponentLink1URL: http://www.szlcsc.com/product/details_7114.html; Package: SOP-4_P2.54; Supplier: LC; SuppliersPartNumber: C6649

## Sheet RP2040_MCU.SchDoc: RP2040 CNC
size B; Author: AM; CompanyName: Expatria Technologies; DrawnBy: A.Marles; Engineer: AM; Organization: Expatria Technolgoies; Address1: Schematic; DocumentNumber: 3; Revision: A6; SheetNumber: 3; SheetTotal: 4
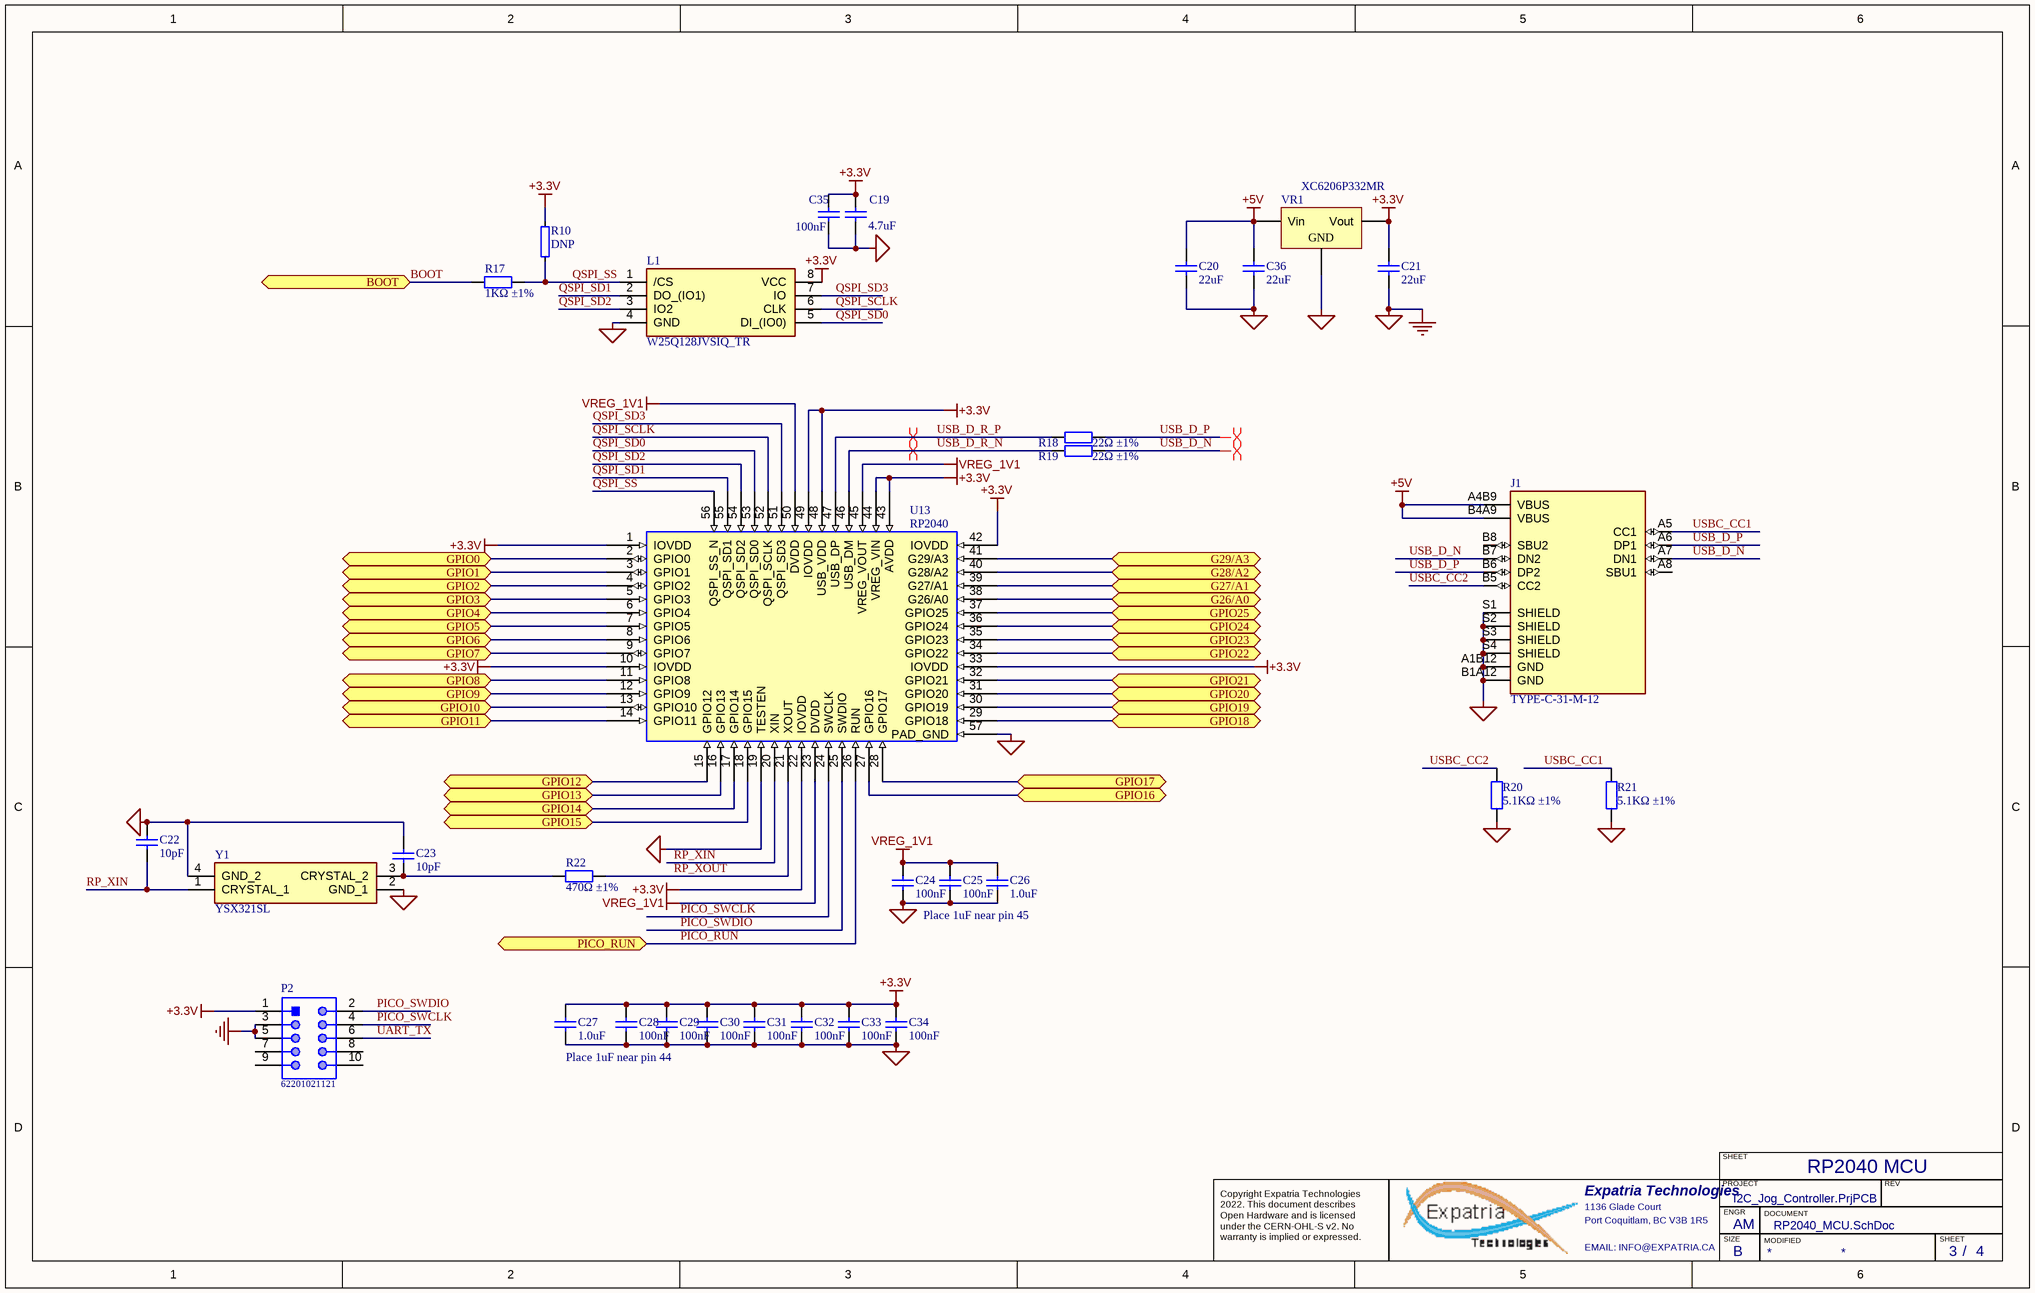
[diagram p7: RP2040_MCU.SchDoc]

### Parts
(Parts that share a designator on the sheet are numbered #1, #2 ... from top to bottom, then left to right.)
C19  4.7uF  [0402_C]
C20  22uF  [0805_C]
C21  22uF  [0805_C]
C22  10pF  [0402_C]
C23  10pF  [0402_C]
C24  100nF  [0402_C]
C25  100nF  [0402_C]
C26  1.0uF  [0402_C]
C27  1.0uF  [0402_C]
C28  100nF  [0402_C]
C29  100nF  [0402_C]
C30  100nF  [0402_C]
C31  100nF  [0402_C]
C32  100nF  [0402_C]
C33  100nF  [0402_C]
C34  100nF  [0402_C]
C35  100nF  [0402_C]
C36  22uF  [0805_C]
J1#2  TYPE-C-31-M-12  [HRO_TYPE-C-31-M-12]
L1  W25Q128JVSIQ_TR  [SOIC127P780X195-8N]
P2  62201021121  [62201021121]  (no BOM)
R10  DNP  [0402]
R17  1KΩ ±1%  [0402_R]
R18  22Ω ±1%  [0402_R]
R19  22Ω ±1%  [0402_R]
R20  5.1KΩ ±1%  [0402_R]
R21  5.1KΩ ±1%  [0402_R]
R22  470Ω ±1%  [0402_R]
U13  RP2040  [RP2040]
VR1  XC6206P332MR  [SOT-23-3L]
Y1  YSX321SL  [YSX321SL]

### Ports
BOOT (bidir), G26/A0 (bidir), G27/A1 (bidir), G28/A2 (bidir), G29/A3 (bidir), GPIO0 (bidir), GPIO1 (bidir), GPIO2 (bidir), GPIO3 (bidir), GPIO4 (bidir), GPIO5 (bidir), GPIO6 (bidir), GPIO7 (bidir), GPIO8 (bidir), GPIO9 (bidir), GPIO10 (bidir), GPIO11 (bidir), GPIO12 (bidir), GPIO13 (bidir), GPIO14 (bidir), GPIO15 (bidir), GPIO16 (bidir), GPIO17 (bidir), GPIO18 (bidir), GPIO19 (bidir), GPIO20 (bidir), GPIO21 (bidir), GPIO22 (bidir), GPIO23 (bidir), GPIO24 (bidir), GPIO25 (bidir), PICO_RUN (bidir)

### Nets
+3.3V: C19.2 C21.2 C27.2 C28.2 C29.2 C30.2 C31.2 C32.2 C33.2 C34.2 C35.2 L1.8(VCC) P2.1 R10.2 U13.1(IOVDD) U13.10(IOVDD) U13.22(IOVDD) U13.33(IOVDD) U13.42(IOVDD) U13.43(AVDD) U13.44(VREG_VIN) U13.48(USB_VDD) U13.49(IOVDD) VR1.2(Vout)
+5V: C20.2 C36.2 J1#2.A4B9(VBUS) J1#2.B4A9(VBUS) VR1.3(Vin)
GND: C19.1 C20.1 C21.1 C22.2 C23.2 C24.1 C25.1 C26.1 C27.1 C28.1 C29.1 C30.1 C31.1 C32.1 C33.1 C34.1 C35.1 C36.1 J1#2.A1B12(GND) J1#2.B1A12(GND) J1#2.S1(SHIELD) J1#2.S2(SHIELD) J1#2.S3(SHIELD) J1#2.S4(SHIELD) L1.4(GND) P2.3 P2.5 R20.2 R21.2 U13.19(TESTEN) U13.57(PAD_GND) VR1.1(GND) Y1.2(GND_1) Y1.4(GND_2)  [also labelled MCU_GND]
VREG_1V1: C24.2 C25.2 C26.2 U13.23(DVDD) U13.45(VREG_VOUT) U13.50(DVDD)
BOOT: R17.1 ; port BOOT
G26/A0: U13.38(G26/A0) ; port G26/A0
G27/A1: U13.39(G27/A1) ; port G27/A1
G28/A2: U13.40(G28/A2) ; port G28/A2
G29/A3: U13.41(G29/A3) ; port G29/A3
GPIO0: U13.2(GPIO0) ; port GPIO0
GPIO1: U13.3(GPIO1) ; port GPIO1
GPIO2: U13.4(GPIO2) ; port GPIO2
GPIO3: U13.5(GPIO3) ; port GPIO3
GPIO4: U13.6(GPIO4) ; port GPIO4
GPIO5: U13.7(GPIO5) ; port GPIO5
GPIO6: U13.8(GPIO6) ; port GPIO6
GPIO7: U13.9(GPIO7) ; port GPIO7
GPIO8: U13.11(GPIO8) ; port GPIO8
GPIO9: U13.12(GPIO9) ; port GPIO9
GPIO10: U13.13(GPIO10) ; port GPIO10
GPIO11: U13.14(GPIO11) ; port GPIO11
GPIO12: U13.15(GPIO12) ; port GPIO12
GPIO13: U13.16(GPIO13) ; port GPIO13
GPIO14: U13.17(GPIO14) ; port GPIO14
GPIO15: U13.18(GPIO15) ; port GPIO15
GPIO16: U13.27(GPIO16) ; port GPIO16
GPIO17: U13.28(GPIO17) ; port GPIO17
GPIO18: U13.29(GPIO18) ; port GPIO18
GPIO19: U13.30(GPIO19) ; port GPIO19
GPIO20: U13.31(GPIO20) ; port GPIO20
GPIO21: U13.32(GPIO21) ; port GPIO21
GPIO22: U13.34(GPIO22) ; port GPIO22
GPIO23: U13.35(GPIO23) ; port GPIO23
GPIO24: U13.36(GPIO24) ; port GPIO24
GPIO25: U13.37(GPIO25) ; port GPIO25
PICO_RUN: U13.26(RUN) ; port PICO_RUN
PICO_SWCLK: P2.4 U13.24(SWCLK)
PICO_SWDIO: P2.2 U13.25(SWDIO)
QSPI_SCLK: L1.6(CLK) U13.52(QSPI_SCLK)
QSPI_SD0: L1.5(DI_(IO0)) U13.53(QSPI_SD0)
QSPI_SD1: L1.2(DO_(IO1)) U13.55(QSPI_SD1)
QSPI_SD2: L1.3(IO2) U13.54(QSPI_SD2)
QSPI_SD3: L1.7(IO) U13.51(QSPI_SD3)
QSPI_SS: L1.1(/CS) R10.1 R17.2 U13.56(QSPI_SS_N)
RP_XIN: C22.1 U13.20(XIN) Y1.1(CRYSTAL_1)
RP_XOUT: R22.2 U13.21(XOUT)
UART_TX: P2.6
USB_D_N: J1#2.A7(DN1) J1#2.B7(DN2) R19.1
USB_D_P: J1#2.A6(DP1) J1#2.B6(DP2) R18.1
USB_D_R_N: R19.2 U13.46(USB_DM)
USB_D_R_P: R18.2 U13.47(USB_DP)
USBC_CC1: J1#2.A5(CC1) R21.1
USBC_CC2: J1#2.B5(CC2) R20.1
NetC23_1: C23.1 R22.1 Y1.3(CRYSTAL_2)

Not connected (* = marked no-connect by the designer): J1#2 A8(SBU1) B8(SBU2); P2 7 8 9 10

### Layout directives
differential pair: USB_D_N, USB_D_P, USB_D_R_N, USB_D_R_P

### Notes on the sheet
- Place 1uF near pin 45
- Place 1uF near pin 44
- RP2040 MCU
- SHEET
- Expatria Technologies
- 1136 Glade Court
- Port Coquitlam, BC V3B 1R5
- PROJECT
- SIZE
- ENGR
- MODIFIED
- DOCUMENT
- REV
- Copyright Expatria Technologies 2022. This document describes Open Hardware and is licensed under the CERN-OHL-S v2. No warranty is implied or expressed.
- EMAIL: INFO@EXPATRIA.CA
- B
- /

### Library data of the parts
C19 = 0402 4.7uF (475) 20% 10V: Chip capacitor; Manufacturer: Samsung Electro-Mechanics; PartNumber: CL05A475MP5NRNC; Tolerance: 20%; Voltage: 10V; ComponentLink1Description: Supplier link; ComponentLink1URL: http://www.szlcsc.com/product/details_24469.html; Package: 0402; Supplier: LC; SuppliersPartNumber: C23733; Capacitance: 4.7uF
C20 C21 C36 = 0805 22uF (226) 20% 25V: Chip capacitors; Manufacturer: Samsung Electro-Mechanics; PartNumber: CL21A226MAQNNNE; Tolerance: 20%; Voltage: 25V; Package: 0805; Supplier: LC; SuppliersPartNumber: C2922481; Capacitance: 22uF; ComponentLink1Description: Supplier link; ComponentLink1URL: http://www.szlcsc.com/product/details_46786.html
C22 C23 = 0402 10pF (100) 5% 50V: Chip capacitors; Manufacturer: Samsung Electro-Mechanics; PartNumber: CL05C100JB5NNNC; Tolerance: 5%; Voltage: 50V; ComponentLink1Description: Supplier link; ComponentLink1URL: http://www.szlcsc.com/product/details_33914.html; Package: 0402; Supplier: LC; SuppliersPartNumber: C32949; Capacitance: 10pF
C24 C25 C28-C35 = 0402 100nF (104) 10% 16V: as C1 on sheet I2C_Jog_Controller; ComponentLink1Description: Supplier link; ComponentLink1URL: http://www.szlcsc.com/product/details_1877.html; Package: 0402; Supplier: LC; SuppliersPartNumber: C1525; Capacitance: 100nF
C26 C27 = 0402 1.0uF (105) 10% 25V: as C2 on sheet I2C_Jog_Controller; ComponentLink1Description: Supplier link; ComponentLink1URL: http://www.szlcsc.com/product/details_53938.html; Package: 0402; Supplier: LC; SuppliersPartNumber: C52923
J1#2 = TYPE-C-31-M-12: USB Connectors 24 Receptacle 1 8.94*7.3mm RoHS; MF: HRO Electronics Co., Ltd.; Value: *; SnapEDA_Link: https://www.snapeda.com/parts/TYPE-C-31-M-12/HRO%20Electronics%20Co.,%20Ltd./view-part/3228496/?ref=snap; Package: Package; MP: TYPE-C-31-M-12; Price: None; Availability: Unavailable; SuppliersPartNumber: C165948
L1 = W25Q128JVSIQ_TR: Inductor; Manufacturer_Name: Winbond; Manufacturer_Part_Number: W25Q128JVSIQ TR; Datasheet Link: http://www.winbond.com/resource-files/w25q128jv%20spi%20revc%2011162016.pdf; Height: 1.95mm; Mouser Part Number: 454-W25Q128JVSIQTR; Mouser Price/Stock: https://www.mouser.co.uk/ProductDetail/Winbond/W25Q128JVSIQ-TR?qs=qSfuJ%252Bfl%2Fd7vTyLA9kNdGw%3D%3D; Arrow Part Number: W25Q128JVSIQ TR; Arrow Price/Stock: https://www.arrow.com/en/products/w25q128jvsiqtr/winbond-electronics?region=nac; SuppliersPartNumber: C97521
P2 = CMP-1502-00948-1: THT Vertical Pin Header WR-PHD, Pitch 1.27 mm, Dual Row, 10 pins; Manufacturer: Wurth Elektronik; Rated Current: 1A; Pin Number: 10; Working Voltage: 100VAC; Contact Resistance: 20mOhm; Withstanding Voltage: 500VAC; Pitch: 1.27mm; Gender: Male; Mounting Technology: THT; Manufacturer URL: http://www.we-online.de; Package Reference: 62201021121; Row Number: Dual; Datasheet URL: https://katalog.we-online.de/em/datasheet/62201021121.pdf; Publisher: WurthElektronik; Packaging: Box; Operating Temperature: -40to105degC; Orientation: Vertical; Part Number: 62201021121
R10 = RES: Resistor, ±5%, 0.05W; Part Number: R0201-0R; Part number IPS: 00000003245; Value: 0R; Note: Chip Res 5%; Artikkelnr Noca: N.A.; Manufacturer: *; Manufacturer Part Number: *; ComponentLink1URL: *; ComponentLink1Description: Datasheet; ComponentLink2URL: *; ComponentLink2Description: Supplier link; HelpURL: *; Footprint Doc: 0201; LatestRevisionDate: 2017-11-09; Pin Count: 2; Publisher: Nordic Semiconductor; Published: 2014-11-13; Supplier 1: *; Supplier Part Number 1: *; Supplier 2: *; Supplier Part Number 2: *
R17 = 0402 1K (1001) 1%: as R6 on sheet I2C_Keypad; ComponentLink1Description: Supplier link; ComponentLink1URL: http://www.szlcsc.com/product/details_12256.html; Package: 0402; Supplier: LC; SuppliersPartNumber: C11702; Resistance: 1KΩ; Tolerance: 1%
R18 R19 = 0402 22R (22R0) 1%: Chip resistor; Manufacturer: Uniroyal Elec; PartNumber: 0402WGF220JTCE; Power: 1/16W; ComponentLink1Description: Supplier link; ComponentLink1URL: http://www.szlcsc.com/product/details_25835.html; Package: 0402; Supplier: LC; SuppliersPartNumber: C25092; Resistance: 22Ω; Tolerance: 1%
R20 R21 = 0402 5.1K (5101) 1%: Chip resistor; Manufacturer: Uniroyal Elec; PartNumber: 0402WGF5101TCE; Power: 1/16W; Resistance: 51.1KΩ; ComponentLink1Description: Supplier link; ComponentLink1URL: http://www.szlcsc.com/product/details_26648.html; Package: 0402; Supplier: LC; SuppliersPartNumber: C25905; Tolerance: 1%
R22 = 0402 470R (4700) 1%: Chip resistor; Manufacturer: Uniroyal Elec; PartNumber: 0402WGF4700TCE; Power: 1/16W; ComponentLink1Description: Supplier link; ComponentLink1URL: http://www.szlcsc.com/product/details_25860.html; Package: 0402; Supplier: LC; SuppliersPartNumber: C25117; Resistance: 470Ω; Tolerance: 1%
U13 = RP2040: RP2040 First MCU from RPI
VR1 = SOT-23 XC6206P332MR: 200mA 680mV@(100mA) Fixed 3.3V~3.3V Positive 1 6V SOT-23-3L Linear Voltage Regulators (LDO) ROHS; ComponentLink1Description: 供应商链接; ComponentLink1URL: http://www.szlcsc.com/product/details_5896.html; Package: SOT-23; Supplier: LC; SuppliersPartNumber: C5446
Y1 = YSX321SL: Crystal or Oscillator; Manufacturer_Name: YXC; Datasheet Link: https://datasheet.lcsc.com/szlcsc/YSX321SL-30MHZ-10PF-8PPM_C70576.pdf; Height: 0.8mm; Manufacturer_Part_Number: YSX321SL; SuppliersPartNumber: C9002

## Nets that join several sheets
+3.3V: I2C_Jog_Controller (J1#1.36 R1.2 R2.2), RP2040_MCU (24 pins)
+5V: I2C_Jog_Controller (11 pins), I2C_Keypad (9 pins), U_PrintNC_BREAKOUT/UP (UP_R15.1 UP_R16.1 UP_U9.4 UP_U9.8), U_PrintNC_BREAKOUT/DN (DN_R15.1 DN_R16.1 DN_U9.4 DN_U9.8), U_PrintNC_BREAKOUT/LT (LT_R15.1 LT_R16.1 LT_U9.4 LT_U9.8), U_PrintNC_BREAKOUT/RT (RT_R15.1 RT_R16.1 RT_U9.4 RT_U9.8), U_PrintNC_BREAKOUT/RI (RI_R15.1 RI_R16.1 RI_U9.4 RI_U9.8), U_PrintNC_BREAKOUT/LW (LW_R15.1 LW_R16.1 LW_U9.4 LW_U9.8), U_PrintNC_BREAKOUT/JS (JS_R15.1 JS_R16.1 JS_U9.4 JS_U9.8), U_PrintNC_BREAKOUT/FU (FU_R15.1 FU_R16.1 FU_U9.4 FU_U9.8), U_PrintNC_BREAKOUT/FD (FD_R15.1 FD_R16.1 FD_U9.4 FD_U9.8), U_PrintNC_BREAKOUT/FR (FR_R15.1 FR_R16.1 FR_U9.4 FR_U9.8), U_PrintNC_BREAKOUT/SU (SU_R15.1 SU_R16.1 SU_U9.4 SU_U9.8), U_PrintNC_BREAKOUT/SD (SD_R15.1 SD_R16.1 SD_U9.4 SD_U9.8), U_PrintNC_BREAKOUT/SR (SR_R15.1 SR_R16.1 SR_U9.4 SR_U9.8), U_PrintNC_BREAKOUT/SPN (6 pins), U_PrintNC_BREAKOUT/FLD (FLD_R15.1 FLD_R16.1 FLD_U9.4 FLD_U9.8), U_PrintNC_BREAKOUT/MST (MST_R15.1 MST_R16.1 MST_U9.4 MST_U9.8), U_PrintNC_BREAKOUT/CYC (6 pins), U_PrintNC_BREAKOUT/FHL (6 pins), U_PrintNC_BREAKOUT/HLT (6 pins), U_PrintNC_BREAKOUT/HME (6 pins), RP2040_MCU (5 pins)
GND: I2C_Jog_Controller (26 pins), I2C_Keypad (19 pins), U_PrintNC_BREAKOUT/UP (5 pins), U_PrintNC_BREAKOUT/DN (5 pins), U_PrintNC_BREAKOUT/LT (5 pins), U_PrintNC_BREAKOUT/RT (5 pins), U_PrintNC_BREAKOUT/RI (5 pins), U_PrintNC_BREAKOUT/LW (5 pins), U_PrintNC_BREAKOUT/JS (5 pins), U_PrintNC_BREAKOUT/FU (5 pins), U_PrintNC_BREAKOUT/FD (5 pins), U_PrintNC_BREAKOUT/FR (5 pins), U_PrintNC_BREAKOUT/SU (5 pins), U_PrintNC_BREAKOUT/SD (5 pins), U_PrintNC_BREAKOUT/SR (5 pins), U_PrintNC_BREAKOUT/SPN (7 pins), U_PrintNC_BREAKOUT/FLD (5 pins), U_PrintNC_BREAKOUT/MST (5 pins), U_PrintNC_BREAKOUT/CYC (7 pins), U_PrintNC_BREAKOUT/FHL (7 pins), U_PrintNC_BREAKOUT/HLT (7 pins), U_PrintNC_BREAKOUT/HME (7 pins), RP2040_MCU (34 pins)
CYC/ST: I2C_Jog_Controller (J1#1.26), U_PrintNC_BREAKOUT/CYC (CYC_U8.3)
DOWN: I2C_Jog_Controller (J1#1.10), U_PrintNC_BREAKOUT/DN (DN_U9.3)
FEED/HOLD: I2C_Jog_Controller (J1#1.25), U_PrintNC_BREAKOUT/FHL (FHL_U8.3)
FEEDOVR/DN: I2C_Jog_Controller (J1#1.16), U_PrintNC_BREAKOUT/FD (FD_U9.3)
FEEDOVR/RESET: I2C_Jog_Controller (J1#1.17), U_PrintNC_BREAKOUT/FR (FR_U9.3)
FEEDOVR/UP: I2C_Jog_Controller (J1#1.6), U_PrintNC_BREAKOUT/FU (FU_U9.3)
FLOOD: I2C_Jog_Controller (J1#1.22), U_PrintNC_BREAKOUT/FLD (FLD_U9.3)
HALT: I2C_Jog_Controller (J1#1.7), I2C_Keypad (R11.2), U_PrintNC_BREAKOUT/HLT (HLT_U8.3)
HOME: I2C_Jog_Controller (J1#1.32), U_PrintNC_BREAKOUT/HME (HME_U8.3)
JOG/SEL: I2C_Jog_Controller (J1#1.19), U_PrintNC_BREAKOUT/JS (JS_U9.3)
KPSTR: I2C_Jog_Controller (J1#1.34), I2C_Keypad (R12.1)
LED_IN: I2C_Jog_Controller (U4.2), U_PrintNC_BREAKOUT/HLT (HLT_U7.4)
LED_IN: I2C_Jog_Controller (U5.2), U_PrintNC_BREAKOUT/HME (HME_U7.4)
LED_IN: U_PrintNC_BREAKOUT/SPN (SPN_U7.4), U_PrintNC_BREAKOUT/CYC (CYC_U7.2)
LED_IN: U_PrintNC_BREAKOUT/CYC (CYC_U7.4), U_PrintNC_BREAKOUT/FHL (FHL_U7.2)
LED_IN: U_PrintNC_BREAKOUT/FHL (FHL_U7.4), U_PrintNC_BREAKOUT/HLT (HLT_U7.2)
LED_OUT: I2C_Jog_Controller (U5.4), U_PrintNC_BREAKOUT/SPN (SPN_U7.2)
LEFT: I2C_Jog_Controller (J1#1.11), U_PrintNC_BREAKOUT/LT (LT_U9.3)
LOWER: I2C_Jog_Controller (J1#1.14), U_PrintNC_BREAKOUT/LW (LW_U9.3)
MIST: I2C_Jog_Controller (J1#1.24), U_PrintNC_BREAKOUT/MST (MST_U9.3)
RAISE: I2C_Jog_Controller (J1#1.15), U_PrintNC_BREAKOUT/RI (RI_U9.3)
RIGHT: I2C_Jog_Controller (J1#1.12), U_PrintNC_BREAKOUT/RT (RT_U9.3)
SCL: I2C_Jog_Controller (J1#1.2), I2C_Keypad (U6.6)
SDA: I2C_Jog_Controller (J1#1.1), I2C_Keypad (U6.3)
SPINDLE: I2C_Jog_Controller (J1#1.27), U_PrintNC_BREAKOUT/SPN (SPN_U8.3)
SPINOVR/DN: I2C_Jog_Controller (J1#1.21), U_PrintNC_BREAKOUT/SD (SD_U9.3)
SPINOVR/RESET: I2C_Jog_Controller (J1#1.31), U_PrintNC_BREAKOUT/SR (SR_U9.3)
SPINOVR/UP: I2C_Jog_Controller (J1#1.20), U_PrintNC_BREAKOUT/SU (SU_U9.3)
UP: I2C_Jog_Controller (J1#1.9), U_PrintNC_BREAKOUT/UP (UP_U9.3)

## Assembly variants
FULL_ASSEMBLY: not fitted J1 P1